# Altium project Arria10_NetBoard.PrjPcb (part 1 of 2)
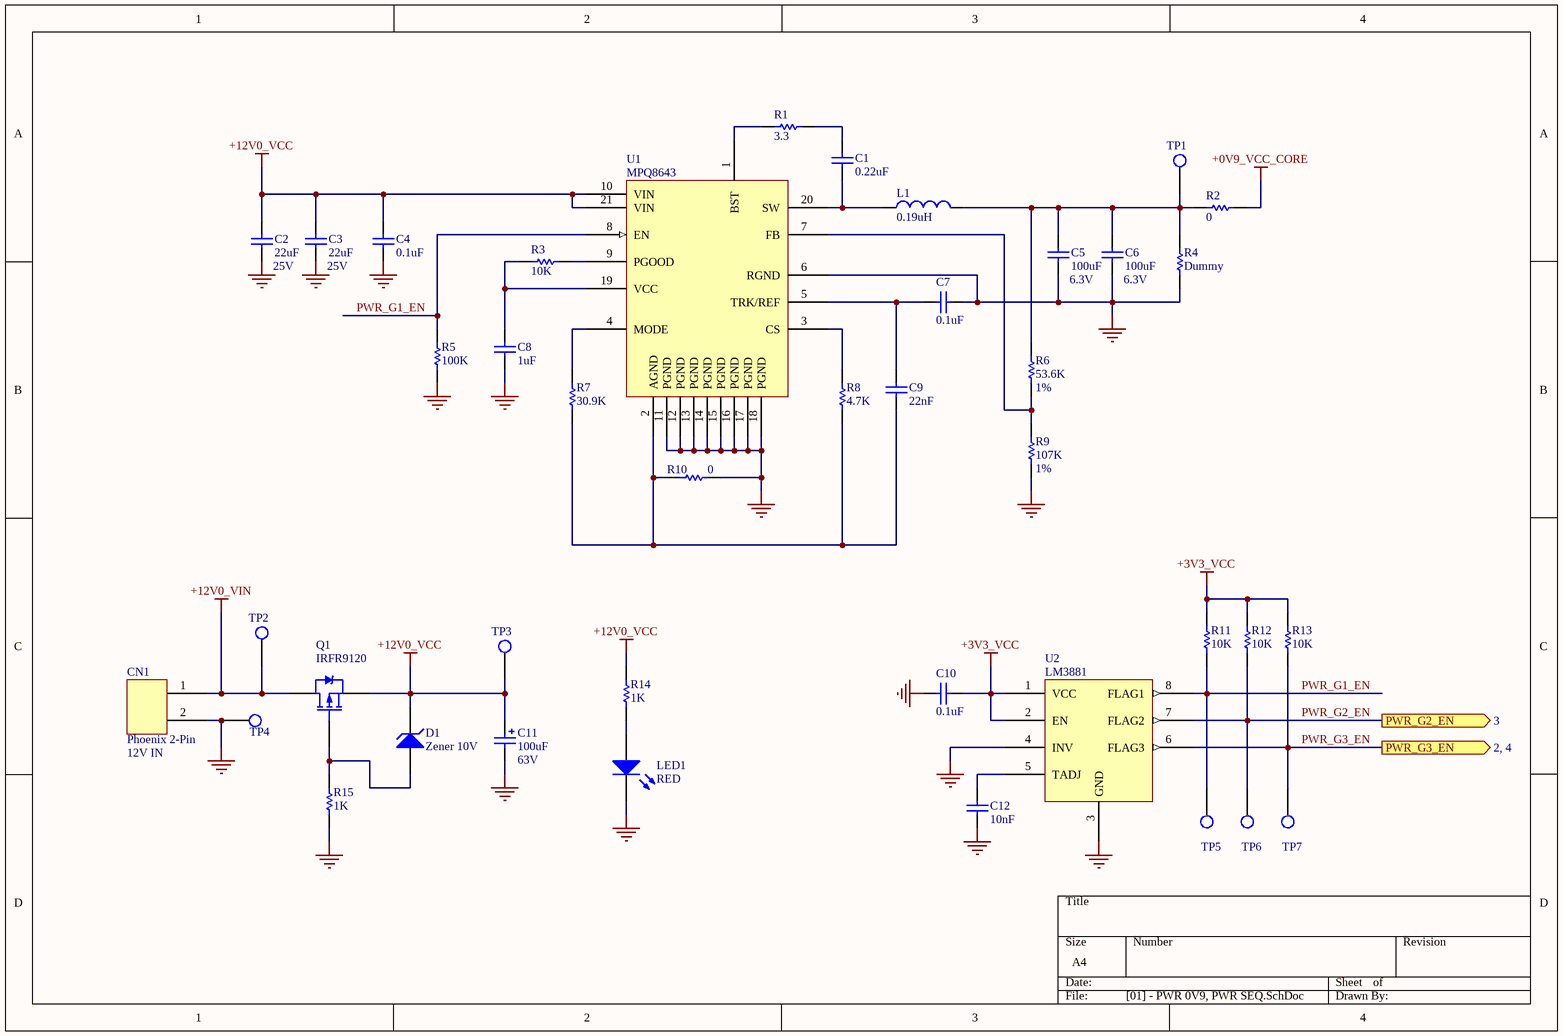
[diagram p0: [01] - PWR 0V9, PWR SEQ.SchDoc]
15 sheets, 570 parts. Net scope: flat (ports and power ports of the same name join across sheets).
Sheets:
  [00] - BLOCK DIAGRAM.SchDoc
  [01] - PWR 0V9, PWR SEQ.SchDoc
  [02] - PWR 1V8.SchDoc
  [03] - PWR 3V3, 1V0.SchDoc
  [04] - PWR 2V5, 1V8, 1V35.SchDoc
  [05] - FPGA PWR.SchDoc
  [06] - FPGA CONFIG, TEMP MON.SchDoc
  [07] - FPGA XCVR.SchDoc
  [08] - FPGA - DDR3.SchDoc
  [09] - FPGA IO BANK 2A, 2L.SchDoc
  [10] - FPGA IO BANK 3A.SchDoc
  [11] - MAIN CLOCKS.SchDoc
  [12] - REFERENCE CLOCKS.SchDoc
  [13] - SFP+ MODULES.SchDoc
  [14] - ETHERNET 10_100_1000.SchDoc

## Sheet [00] - BLOCK DIAGRAM.SchDoc
size A4; DocumentNumber: 0; SheetNumber: 0; SheetTotal: 15

## Sheet [01] - PWR 0V9, PWR SEQ.SchDoc
size A4; DocumentNumber: 1; SheetNumber: 1; SheetTotal: 15

### Parts
C1  0.22uF  [0402_C]
C2  22uF  RATED_VOLTAGE: 25V  [1210_C]
C3  22uF  RATED_VOLTAGE: 25V  [1210_C]
C4  0.1uF  [0402_C]
C5  100uF  RATED_VOLTAGE: 6.3V  [1210_C]
C6  100uF  RATED_VOLTAGE: 6.3V  [1210_C]
C7  0.1uF  [0402_C]
C8  1uF  [0402_C]
C9  22nF  [0402_C]
C10  0.1uF  [0402_C]
C11  100uF  RATED_VOLTAGE: 63V  [G_PANASONIC]
C12  10nF  [0402_C]
CN1  Phoenix 2-Pin  [PHOENIX_2PIN_RIGHT_200mil]
D1  Zener 10V  [SOD-123]
L1  0.19uH  [IHLP-4040]
LED1  RED  [LED_0805]
Q1  IRFR9120  [TO-252]
R1  3.3  [0402_R]
R2  0  [1210_R]
R3  10K  [0402_R]
R4  Dummy  [1210_R]
R5  100K  [0402_R]
R6  53.6K  Tolerance: 1%  [0402_R]
R7  30.9K  [0402_R]
R8  4.7K  [0402_R]
R9  107K  Tolerance: 1%  [0402_R]
R10  0  [0402_R]
R11  10K  [0402_R]
R12  10K  [0402_R]
R13  10K  [0402_R]
R14  1K  [0805_R]
R15  1K  [0805_R]
TP1  Test Point  [PIN_1.5mm]  (value not drawn)
TP2  Test Point  [PIN_1.5mm]  (value not drawn)
TP3  Test Point  [PIN_1.5mm]  (value not drawn)
TP4  Test Point  [PIN_1.5mm]  (value not drawn)
TP5  Test Point  [PIN_1mm]  (value not drawn)
TP6  Test Point  [PIN_1mm]  (value not drawn)
TP7  Test Point  [PIN_1mm]  (value not drawn)
U1  MPQ8643
U2  LM3881

### Ports
PWR_G2_EN (out, see 3), PWR_G3_EN (out, see 2, 4)

### Nets
+0V9_VCC_CORE: R2.2
+3V3_VCC: C10.1 R11.2 R12.2 R13.2 U2.1(VCC) U2.2(EN)
+12V0_VCC: C2.2 C3.2 C4.2 C11.1 D1.2(K) Q1.2(S) R14.2 TP3.1 U1.10(VIN) U1.21(VIN)
+12V0_VIN: CN1.1 Q1.3(D) TP2.1
GND: C2.1 C3.1 C4.1 C5.1 C6.1 C7.1 C8.1 C10.2 C11.2 C12.2 CN1.2 LED1.2(K) R4.1 R5.2 R9.1 R10.2 R15.1 TP4.1 U1.6(RGND) U1.11(PGND) U1.12(PGND) U1.13(PGND) U1.14(PGND) U1.15(PGND) U1.16(PGND) U1.17(PGND) U1.18(PGND) U2.3(GND) U2.4(INV)
PWR_G1_EN: R5.1 R11.1 TP5.1 U1.8(EN) U2.8(FLAG1)
PWR_G2_EN: R12.1 TP6.1 U2.7(FLAG2) ; port PWR_G2_EN
PWR_G3_EN: R13.1 TP7.1 U2.6(FLAG3) ; port PWR_G3_EN
NetC1_1: C1.1 L1.1 U1.20(SW)
NetC1_2: C1.2 R1.2
NetC5_2: C5.2 C6.2 L1.2 R2.1 R4.2 R6.2 TP1.1
NetC7_2: C7.2 C9.2 U1.5(TRK/REF)
NetC8_2: C8.2 R3.2 U1.19(VCC)
NetC9_1: C9.1 R7.1 R8.1 R10.1 U1.2(AGND)
NetC12_1: C12.1 U2.5(TADJ)
NetD1_1: D1.1(A) Q1.1(G) R15.2
NetLED1_1: LED1.1(A) R14.1
NetR1_1: R1.1 U1.1(BST)
NetR3_1: R3.1 U1.9(PGOOD)
NetR6_1: R6.1 R9.2 U1.7(FB)
NetR7_2: R7.2 U1.4(MODE)
NetR8_2: R8.2 U1.3(CS)

### Notes on the sheet
- (near CN1) 12V IN

### Library data of the parts
C1 = Cap SMD: Non-Pol SMD Capacitor; RATED_VOLTAGE: 25V; Value: 0.22uF; Manufacturer Part Num: *; Dielectric: *
C2 C3 = Cap SMD: Non-Pol SMD Capacitor; Manufacturer Part Num: GRM32ER71E226KE15; Dielectric: X7R; Value: 22uF
C4 C7-C10 C12 = Cap SMD: Non-Pol SMD Capacitor; RATED_VOLTAGE: 16V; Manufacturer Part Num: *; Dielectric: *
  C4 C7 C10: Value: 0.1uF
  C8: Value: 1uF
  C9: Value: 22nF
  C12: Value: 10nF
C5 C6 = Cap SMD: Non-Pol SMD Capacitor; Manufacturer Part Num: GRM32EC70J107ME15; Dielectric: X7S; Value: 100uF
C11 = Cap Aluminium Electrolytic: Aluminium Electrolytic Capacitor; Manufacturer Part Num: EEE-TG1J101UP; Value: 100uF
CN1 = Phoenix 2 pin: 2-Pin Phoenix Terminal; Value: Phoenix 2-Pin
D1 = Diode Zener: Zener Diode; Manufacturer Part Num: BZT52C10-7-F; Value: Zener 10V
L1 = Inductor: Inductor SMD; Manufacturer Part Num: IHLP4040DZERR19M11; Value: 0.19uH
LED1 = LED: Typical LED; Value: RED
Q1 = MOSFET P-CH: P-Channel Mosfet; Manufacturer Part Num: IRFR9120PBF; Value: IRFR9120
R1-R5 R7 R8 R10-R15 = Res SMD: SMD Resistor; Tolerance: 5%; Manufacturer Part Num: *
  R1: Value: 3.3
  R2 R10: Value: 0
  R3 R11-R13: Value: 10K
  R4: Value: Dummy
  R5: Value: 100K
  R7: Value: 30.9K
  R8: Value: 4.7K
  R14 R15: Value: 1K
R6 R9 = Res SMD: SMD Resistor; Manufacturer Part Num: *
  R6: Value: 53.6K
  R9: Value: 107K
TP1-TP7 = Test Point: Test Point Footprint; Value: Test Point
U1 = MPQ8643: 16V, 20A, Configurable-Frequency, Synchronous Step-Down Converter; Manufacturer Part Num: MPQ8643GLE-P; Value: MPQ8643
U2 = LM3881: Simple Power Sequencer With Adjustable Timing; Value: LM3881; Manufacturer Part Num: *

## Sheet [02] - PWR 1V8.SchDoc
size A4; DocumentNumber: 2; SheetNumber: 2; SheetTotal: 15
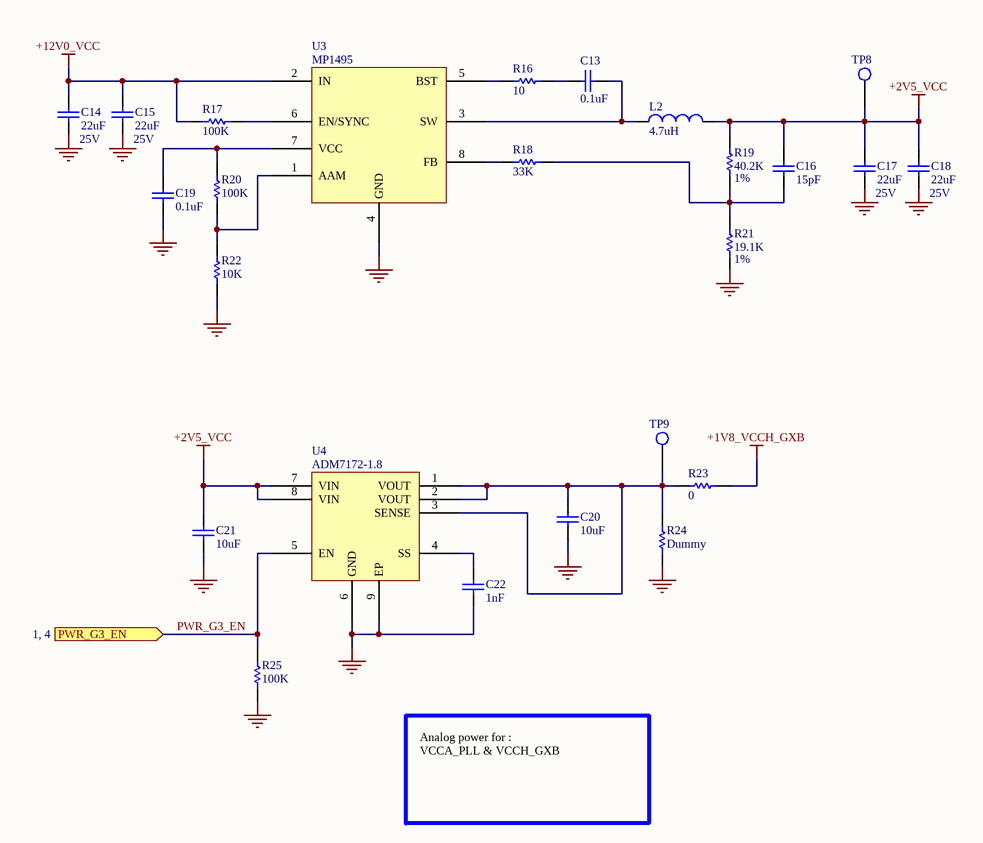
[diagram p1: [02] - PWR 1V8.SchDoc]

### Parts
C13  0.1uF  [0402_C]
C14  22uF  RATED_VOLTAGE: 25V  [1210_C]
C15  22uF  RATED_VOLTAGE: 25V  [1210_C]
C16  15pF  [0402_C]
C17  22uF  RATED_VOLTAGE: 25V  [1210_C]
C18  22uF  RATED_VOLTAGE: 25V  [1210_C]
C19  0.1uF  [0402_C]
C20  10uF  [0805_C]
C21  10uF  [0805_C]
C22  1nF  [0402_C]
L2  4.7uH  [IHLP-2525]
R16  10  [0402_R]
R17  100K  [0402_R]
R18  33K  [0402_R]
R19  40.2K  Tolerance: 1%  [0402_R]
R20  100K  [0402_R]
R21  19.1K  Tolerance: 1%  [0402_R]
R22  10K  [0402_R]
R23  0  [1210_R]
R24  Dummy  [1210_R]
R25  100K  [0402_R]
TP8  Test Point  [PIN_1.5mm]  (value not drawn)
TP9  Test Point  [PIN_1.5mm]  (value not drawn)
U3  MP1495  [TSOT23-8]
U4  ADM7172-1.8

### Ports
PWR_G3_EN (in, see 1, 4)

### Nets
+1V8_VCCH_GXB: R23.2
+2V5_VCC: C16.2 C17.2 C18.2 C21.2 L2.2 R19.2 TP8.1 U4.7(VIN) U4.8(VIN)
+12V0_VCC: C14.2 C15.2 R17.2 U3.2(IN)
GND: C14.1 C15.1 C17.1 C18.1 C19.1 C20.1 C21.1 C22.1 R21.1 R22.1 R24.1 R25.2 U3.4(GND) U4.6(GND) U4.9(EP)
PWR_G3_EN: R25.1 U4.5(EN) ; port PWR_G3_EN
NetC13_1: C13.1 R16.2
NetC13_2: C13.2 L2.1 U3.3(SW)
NetC16_1: C16.1 R18.2 R19.1 R21.2
NetC19_2: C19.2 R20.2 U3.7(VCC)
NetC20_2: C20.2 R23.1 R24.2 TP9.1 U4.1(VOUT) U4.2(VOUT) U4.3(SENSE)
NetC22_2: C22.2 U4.4(SS)
NetR16_1: R16.1 U3.5(BST)
NetR17_1: R17.1 U3.6(EN/SYNC)
NetR18_1: R18.1 U3.8(FB)
NetR20_1: R20.1 R22.2 U3.1(AAM)

### Notes on the sheet
- Analog power for :
  VCCA_PLL & VCCH_GXB

### Library data of the parts
C13 C19 = Cap SMD: as C1 on sheet [01] - PWR 0V9, PWR SEQ; Value: 0.1uF; Manufacturer Part Num: *; Dielectric: *
C14 C15 C17 C18 = Cap SMD: as C2 on sheet [01] - PWR 0V9, PWR SEQ; Value: 22uF
C16 C22 = Cap SMD: as C4 on sheet [01] - PWR 0V9, PWR SEQ; Manufacturer Part Num: *; Dielectric: *
  C16: Value: 15pF
  C22: Value: 1nF
C20 C21 = Cap SMD: Non-Pol SMD Capacitor; Manufacturer Part Num: GRM21BR71A106MA73; RATED_VOLTAGE: 10V; Dielectric: X7R; Value: 10uF
L2 = Inductor: Inductor SMD; Manufacturer Part Num: IHLP2525CZER4R7M01; Value: 4.7uH
R16-R18 R20 R22-R25 = Res SMD: SMD Resistor; Tolerance: 5%; Manufacturer Part Num: *
  R16: Value: 10
  R17 R20 R25: Value: 100K
  R18: Value: 33K
  R22: Value: 10K
  R23: Value: 0
  R24: Value: Dummy
R19 R21 = Res SMD: SMD Resistor; Manufacturer Part Num: *
  R19: Value: 40.2K
  R21: Value: 19.1K
TP8 TP9 = Test Point: Test Point Footprint; Value: Test Point
U3 = MP1495: High Efficiency 3A, 16V, 500kHz Synchronous Step Down Converter; Manufacturer Part Num: MP1495SGJ-Z; Value: MP1495
U4 = ADM7172: 6.5 V, 2 A, Ultralow Noise, High PSRR, Fast Transient Response CMOS LDO; Manufacturer Part Num: ADM7172ACPZ-1.8-R7; Value: ADM7172-1.8

## Sheet [03] - PWR 3V3, 1V0.SchDoc
size A4; DocumentNumber: 3; SheetNumber: 3; SheetTotal: 15
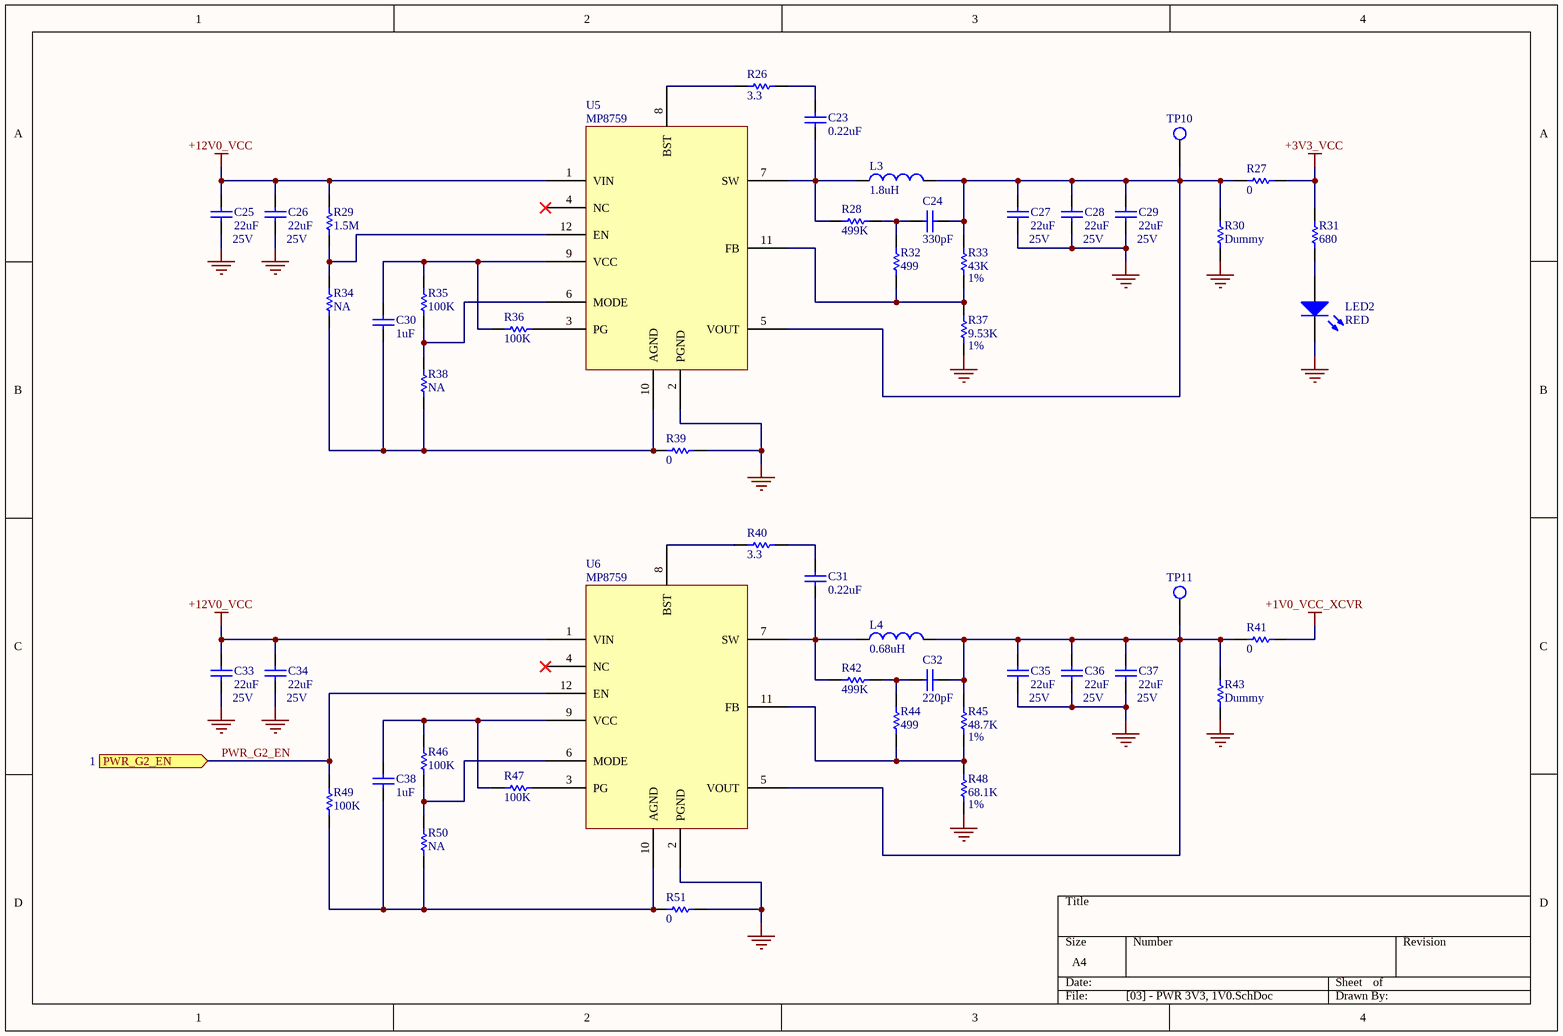
[diagram p2: [03] - PWR 3V3, 1V0.SchDoc]

### Parts
C23  0.22uF  [0402_C]
C24  330pF  [0402_C]
C25  22uF  RATED_VOLTAGE: 25V  [1210_C]
C26  22uF  RATED_VOLTAGE: 25V  [1210_C]
C27  22uF  RATED_VOLTAGE: 25V  [1210_C]
C28  22uF  RATED_VOLTAGE: 25V  [1210_C]
C29  22uF  RATED_VOLTAGE: 25V  [1210_C]
C30  1uF  [0402_C]
C31  0.22uF  [0402_C]
C32  220pF  [0402_C]
C33  22uF  RATED_VOLTAGE: 25V  [1210_C]
C34  22uF  RATED_VOLTAGE: 25V  [1210_C]
C35  22uF  RATED_VOLTAGE: 25V  [1210_C]
C36  22uF  RATED_VOLTAGE: 25V  [1210_C]
C37  22uF  RATED_VOLTAGE: 25V  [1210_C]
C38  1uF  [0402_C]
L3  1.8uH  [IHLP-4040]
L4  0.68uH  [IHLP-2525]
LED2  RED  [LED_0805]
R26  3.3  [0402_R]
R27  0  [1210_R]
R28  499K  [0402_R]
R29  1.5M  [0402_R]
R30  Dummy  [1210_R]
R31  680  [0805_R]
R32  499  [0402_R]
R33  43K  Tolerance: 1%  [0402_R]
R34  NA  [0402_R]
R35  100K  [0402_R]
R36  100K  [0402_R]
R37  9.53K  Tolerance: 1%  [0402_R]
R38  NA  [0402_R]
R39  0  [0402_R]
R40  3.3  [0402_R]
R41  0  [1210_R]
R42  499K  [0402_R]
R43  Dummy  [1210_R]
R44  499  [0402_R]
R45  48.7K  Tolerance: 1%  [0402_R]
R46  100K  [0402_R]
R47  100K  [0402_R]
R48  68.1K  Tolerance: 1%  [0402_R]
R49  100K  [0402_R]
R50  NA  [0402_R]
R51  0  [0402_R]
TP10  Test Point  [PIN_1.5mm]  (value not drawn)
TP11  Test Point  [PIN_1.5mm]  (value not drawn)
U5  MP8759
U6  MP8759

### Ports
PWR_G2_EN (in, see 1)

### Nets
+1V0_VCC_XCVR: R41.2
+3V3_VCC: R27.2 R31.2
+12V0_VCC: C25.2 C26.2 C33.2 C34.2 R29.1 U5.1(VIN) U6.1(VIN)
GND: C25.1 C26.1 C27.1 C28.1 C29.1 C33.1 C34.1 C35.1 C36.1 C37.1 LED2.2(K) R30.1 R37.1 R39.1 R43.1 R48.1 R51.1 U5.2(PGND) U6.2(PGND)
PWR_G2_EN: R49.1 U6.12(EN) ; port PWR_G2_EN
NetC23_1: C23.1 L3.1 R28.2 U5.7(SW)
NetC23_2: C23.2 R26.2
NetC24_1: C24.1 C27.2 C28.2 C29.2 L3.2 R27.1 R30.2 R33.2 TP10.1 U5.5(VOUT)
NetC24_2: C24.2 R28.1 R32.1
NetC30_1: C30.1 R34.2 R38.2 R39.2 U5.10(AGND)
NetC30_2: C30.2 R35.1 R36.2 U5.9(VCC)
NetC31_1: C31.1 L4.1 R42.2 U6.7(SW)
NetC31_2: C31.2 R40.2
NetC32_1: C32.1 C35.2 C36.2 C37.2 L4.2 R41.1 R43.2 R45.2 TP11.1 U6.5(VOUT)
NetC32_2: C32.2 R42.1 R44.1
NetC38_1: C38.1 R49.2 R50.2 R51.2 U6.10(AGND)
NetC38_2: C38.2 R46.1 R47.2 U6.9(VCC)
NetLED2_1: LED2.1(A) R31.1
NetR26_1: R26.1 U5.8(BST)
NetR29_2: R29.2 R34.1 U5.12(EN)
NetR32_2: R32.2 R33.1 R37.2 U5.11(FB)
NetR35_2: R35.2 R38.1 U5.6(MODE)
NetR36_1: R36.1 U5.3(PG)
NetR40_1: R40.1 U6.8(BST)
NetR44_2: R44.2 R45.1 R48.2 U6.11(FB)
NetR46_2: R46.2 R50.1 U6.6(MODE)
NetR47_1: R47.1 U6.3(PG)

Not connected (* = marked no-connect by the designer): U5 4(NC)*; U6 4(NC)*

### Library data of the parts
C23 C31 = Cap SMD: as C1 on sheet [01] - PWR 0V9, PWR SEQ; Value: 0.22uF; Manufacturer Part Num: *; Dielectric: *
C24 C32 = Cap SMD: as C4 on sheet [01] - PWR 0V9, PWR SEQ; Manufacturer Part Num: *; Dielectric: *
  C24: Value: 330pF
  C32: Value: 220pF
C25-C29 C33-C37 = Cap SMD: as C2 on sheet [01] - PWR 0V9, PWR SEQ; Value: 22uF
C30 C38 = Cap SMD: Non-Pol SMD Capacitor; Manufacturer Part Num: GCM155C71A105ME38; RATED_VOLTAGE: 10V; Dielectric: X7S; Value: 1uF
L3 = Inductor: Inductor SMD; Manufacturer Part Num: IHLP4040DZER1R8M11; Value: 1.8uH
L4 = Inductor: Inductor SMD; Manufacturer Part Num: IHLP2525CZERR68M01; Value: 0.68uH
LED2 = LED: Typical LED; Value: RED
R26 R27 R29-R31 R34-R36 R38-R41 R43 R46 R47 R49-R51 = Res SMD: SMD Resistor; Tolerance: 5%; Manufacturer Part Num: *
  R26 R40: Value: 3.3
  R27 R39 R41 R51: Value: 0
  R29: Value: 1.5M
  R30 R43: Value: Dummy
  R31: Value: 680
  R34 R38 R50: Value: NA
  R35 R36 R46 R47 R49: Value: 100K
R28 R32 R42 R44 = Res SMD: SMD Resistor; Tolerance: 1%; Manufacturer Part Num: *
  R28 R42: Value: 499K
  R32 R44: Value: 499
R33 R37 R45 R48 = Res SMD: SMD Resistor; Manufacturer Part Num: *
  R33: Value: 43K
  R37: Value: 9.53K
  R45: Value: 48.7K
  R48: Value: 68.1K
TP10 TP11 = Test Point: Test Point Footprint; Value: Test Point
U5 U6 = MP8759: 26V, 8A, Low I Q , High-Current,  Synchronous, Step-Down Converter; Manufacturer Part Num: MP8759GD; Value: MP8759

## Sheet [04] - PWR 2V5, 1V8, 1V35.SchDoc
size A4; DocumentNumber: 4; SheetNumber: 4; SheetTotal: 15
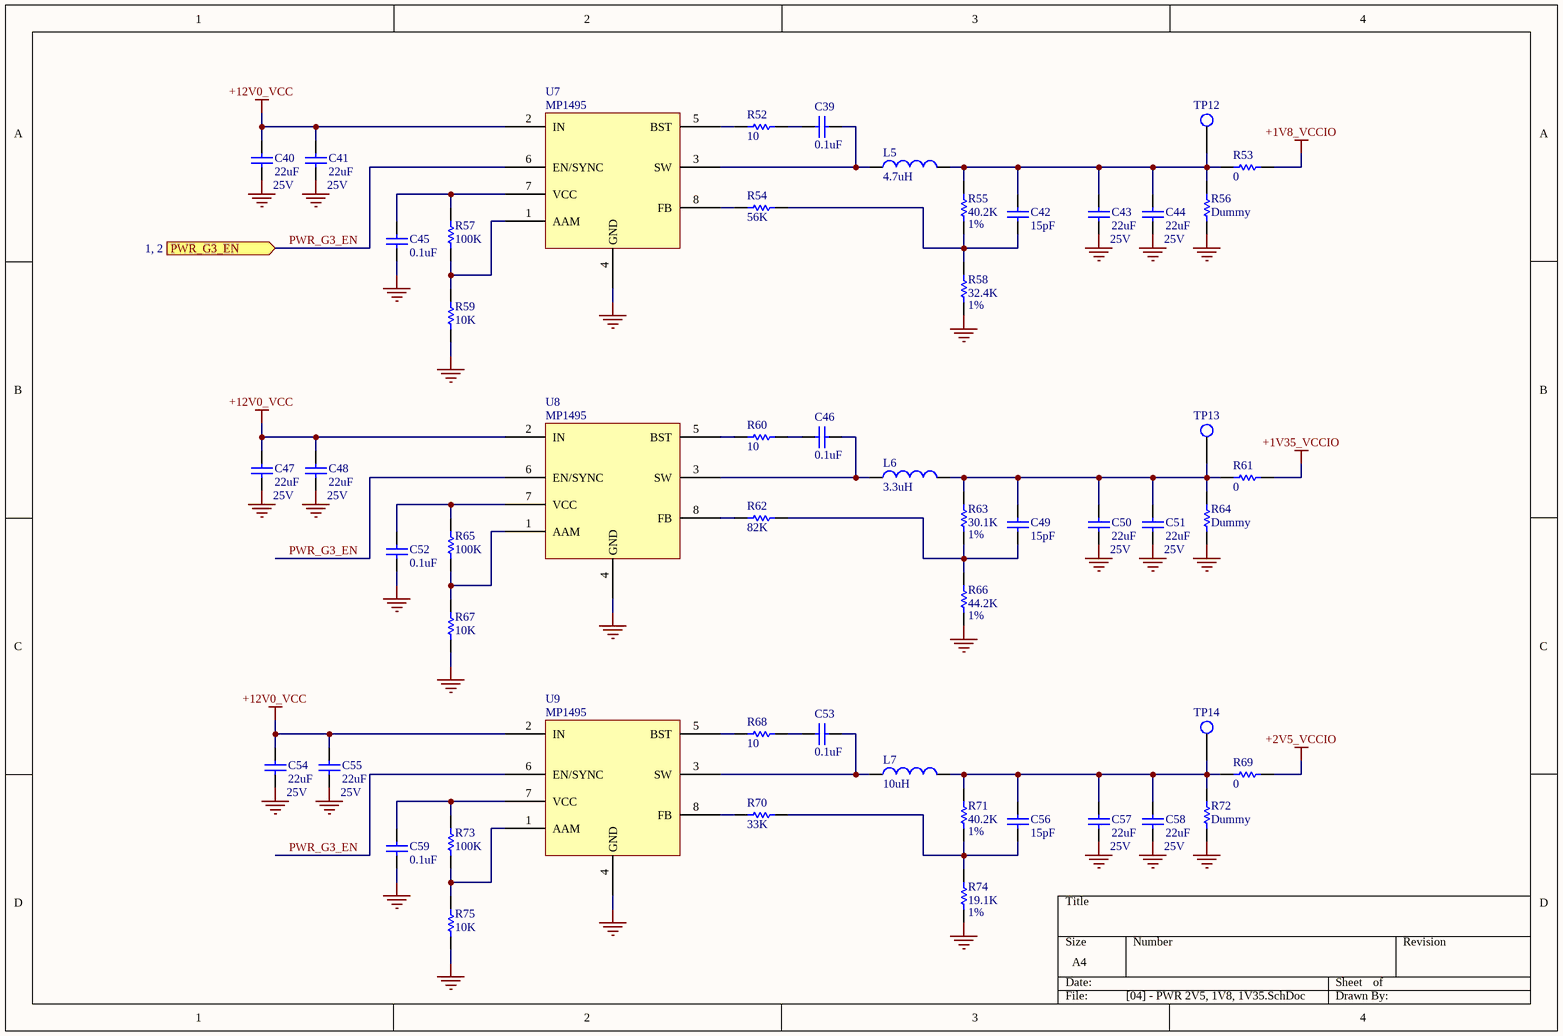
[diagram p3: [04] - PWR 2V5, 1V8, 1V35.SchDoc]

### Parts
C39  0.1uF  [0402_C]
C40  22uF  RATED_VOLTAGE: 25V  [1210_C]
C41  22uF  RATED_VOLTAGE: 25V  [1210_C]
C42  15pF  [0402_C]
C43  22uF  RATED_VOLTAGE: 25V  [1210_C]
C44  22uF  RATED_VOLTAGE: 25V  [1210_C]
C45  0.1uF  [0402_C]
C46  0.1uF  [0402_C]
C47  22uF  RATED_VOLTAGE: 25V  [1210_C]
C48  22uF  RATED_VOLTAGE: 25V  [1210_C]
C49  15pF  [0402_C]
C50  22uF  RATED_VOLTAGE: 25V  [1210_C]
C51  22uF  RATED_VOLTAGE: 25V  [1210_C]
C52  0.1uF  [0402_C]
C53  0.1uF  [0402_C]
C54  22uF  RATED_VOLTAGE: 25V  [1210_C]
C55  22uF  RATED_VOLTAGE: 25V  [1210_C]
C56  15pF  [0402_C]
C57  22uF  RATED_VOLTAGE: 25V  [1210_C]
C58  22uF  RATED_VOLTAGE: 25V  [1210_C]
C59  0.1uF  [0402_C]
L5  4.7uH  [IHLP-2525]
L6  3.3uH  [IHLP-2020]
L7  10uH  [IHLP-2525]
R52  10  [0402_R]
R53  0  [1210_R]
R54  56K  [0402_R]
R55  40.2K  Tolerance: 1%  [0402_R]
R56  Dummy  [1210_R]
R57  100K  [0402_R]
R58  32.4K  Tolerance: 1%  [0402_R]
R59  10K  [0402_R]
R60  10  [0402_R]
R61  0  [1210_R]
R62  82K  [0402_R]
R63  30.1K  Tolerance: 1%  [0402_R]
R64  Dummy  [1210_R]
R65  100K  [0402_R]
R66  44.2K  Tolerance: 1%  [0402_R]
R67  10K  [0402_R]
R68  10  [0402_R]
R69  0  [1210_R]
R70  33K  [0402_R]
R71  40.2K  Tolerance: 1%  [0402_R]
R72  Dummy  [1210_R]
R73  100K  [0402_R]
R74  19.1K  Tolerance: 1%  [0402_R]
R75  10K  [0402_R]
TP12  Test Point  [PIN_1.5mm]  (value not drawn)
TP13  Test Point  [PIN_1.5mm]  (value not drawn)
TP14  Test Point  [PIN_1.5mm]  (value not drawn)
U7  MP1495  [TSOT23-8]
U8  MP1495  [TSOT23-8]
U9  MP1495  [TSOT23-8]

### Ports
PWR_G3_EN (in, see 1, 2)

### Nets
+1V8_VCCIO: R53.2
+1V35_VCCIO: R61.2
+2V5_VCCIO: R69.2
+12V0_VCC: C40.2 C41.2 C47.2 C48.2 C54.2 C55.2 U7.2(IN) U8.2(IN) U9.2(IN)
GND: C40.1 C41.1 C43.1 C44.1 C45.1 C47.1 C48.1 C50.1 C51.1 C52.1 C54.1 C55.1 C57.1 C58.1 C59.1 R56.1 R58.1 R59.1 R64.1 R66.1 R67.1 R72.1 R74.1 R75.1 U7.4(GND) U8.4(GND) U9.4(GND)
PWR_G3_EN: U7.6(EN/SYNC) U8.6(EN/SYNC) U9.6(EN/SYNC) ; port PWR_G3_EN
NetC39_1: C39.1 R52.2
NetC39_2: C39.2 L5.1 U7.3(SW)
NetC42_1: C42.1 R54.2 R55.1 R58.2
NetC42_2: C42.2 C43.2 C44.2 L5.2 R53.1 R55.2 R56.2 TP12.1
NetC45_2: C45.2 R57.2 U7.7(VCC)
NetC46_1: C46.1 R60.2
NetC46_2: C46.2 L6.1 U8.3(SW)
NetC49_1: C49.1 R62.2 R63.1 R66.2
NetC49_2: C49.2 C50.2 C51.2 L6.2 R61.1 R63.2 R64.2 TP13.1
NetC52_2: C52.2 R65.2 U8.7(VCC)
NetC53_1: C53.1 R68.2
NetC53_2: C53.2 L7.1 U9.3(SW)
NetC56_1: C56.1 R70.2 R71.1 R74.2
NetC56_2: C56.2 C57.2 C58.2 L7.2 R69.1 R71.2 R72.2 TP14.1
NetC59_2: C59.2 R73.2 U9.7(VCC)
NetR52_1: R52.1 U7.5(BST)
NetR54_1: R54.1 U7.8(FB)
NetR57_1: R57.1 R59.2 U7.1(AAM)
NetR60_1: R60.1 U8.5(BST)
NetR62_1: R62.1 U8.8(FB)
NetR65_1: R65.1 R67.2 U8.1(AAM)
NetR68_1: R68.1 U9.5(BST)
NetR70_1: R70.1 U9.8(FB)
NetR73_1: R73.1 R75.2 U9.1(AAM)

### Library data of the parts
C39 C45 C46 C52 C53 C59 = Cap SMD: as C1 on sheet [01] - PWR 0V9, PWR SEQ; Value: 0.1uF; Manufacturer Part Num: *; Dielectric: *
C40 C41 C43 C44 C47 C48 C50 C51 C54 C55 C57 C58 = Cap SMD: as C2 on sheet [01] - PWR 0V9, PWR SEQ; Value: 22uF
C42 C49 C56 = Cap SMD: as C4 on sheet [01] - PWR 0V9, PWR SEQ; Value: 15pF; Manufacturer Part Num: *; Dielectric: *
L5 = Inductor: as L2 on sheet [02] - PWR 1V8; Value: 4.7uH
L6 = Inductor: Inductor SMD; Manufacturer Part Num: IHLP2020BZER3R3M5A; Value: 3.3uH
L7 = Inductor: Inductor SMD; Manufacturer Part Num: IHLP2525CZER100M01; Value: 10uH
R52-R54 R56 R57 R59-R62 R64 R65 R67-R70 R72 R73 R75 = Res SMD: SMD Resistor; Tolerance: 5%; Manufacturer Part Num: *
  R52 R60 R68: Value: 10
  R53 R61 R69: Value: 0
  R54: Value: 56K
  R56 R64 R72: Value: Dummy
  R57 R65 R73: Value: 100K
  R59 R67 R75: Value: 10K
  R62: Value: 82K
  R70: Value: 33K
R55 R58 R63 R66 R71 R74 = Res SMD: SMD Resistor; Manufacturer Part Num: *
  R55 R71: Value: 40.2K
  R58: Value: 32.4K
  R63: Value: 30.1K
  R66: Value: 44.2K
  R74: Value: 19.1K
TP12-TP14 = Test Point: Test Point Footprint; Value: Test Point
U7-U9 = MP1495: as U3 on sheet [02] - PWR 1V8; Value: MP1495

## Sheet [05] - FPGA PWR.SchDoc
size A3; DocumentNumber: 5; SheetNumber: 5; SheetTotal: 15
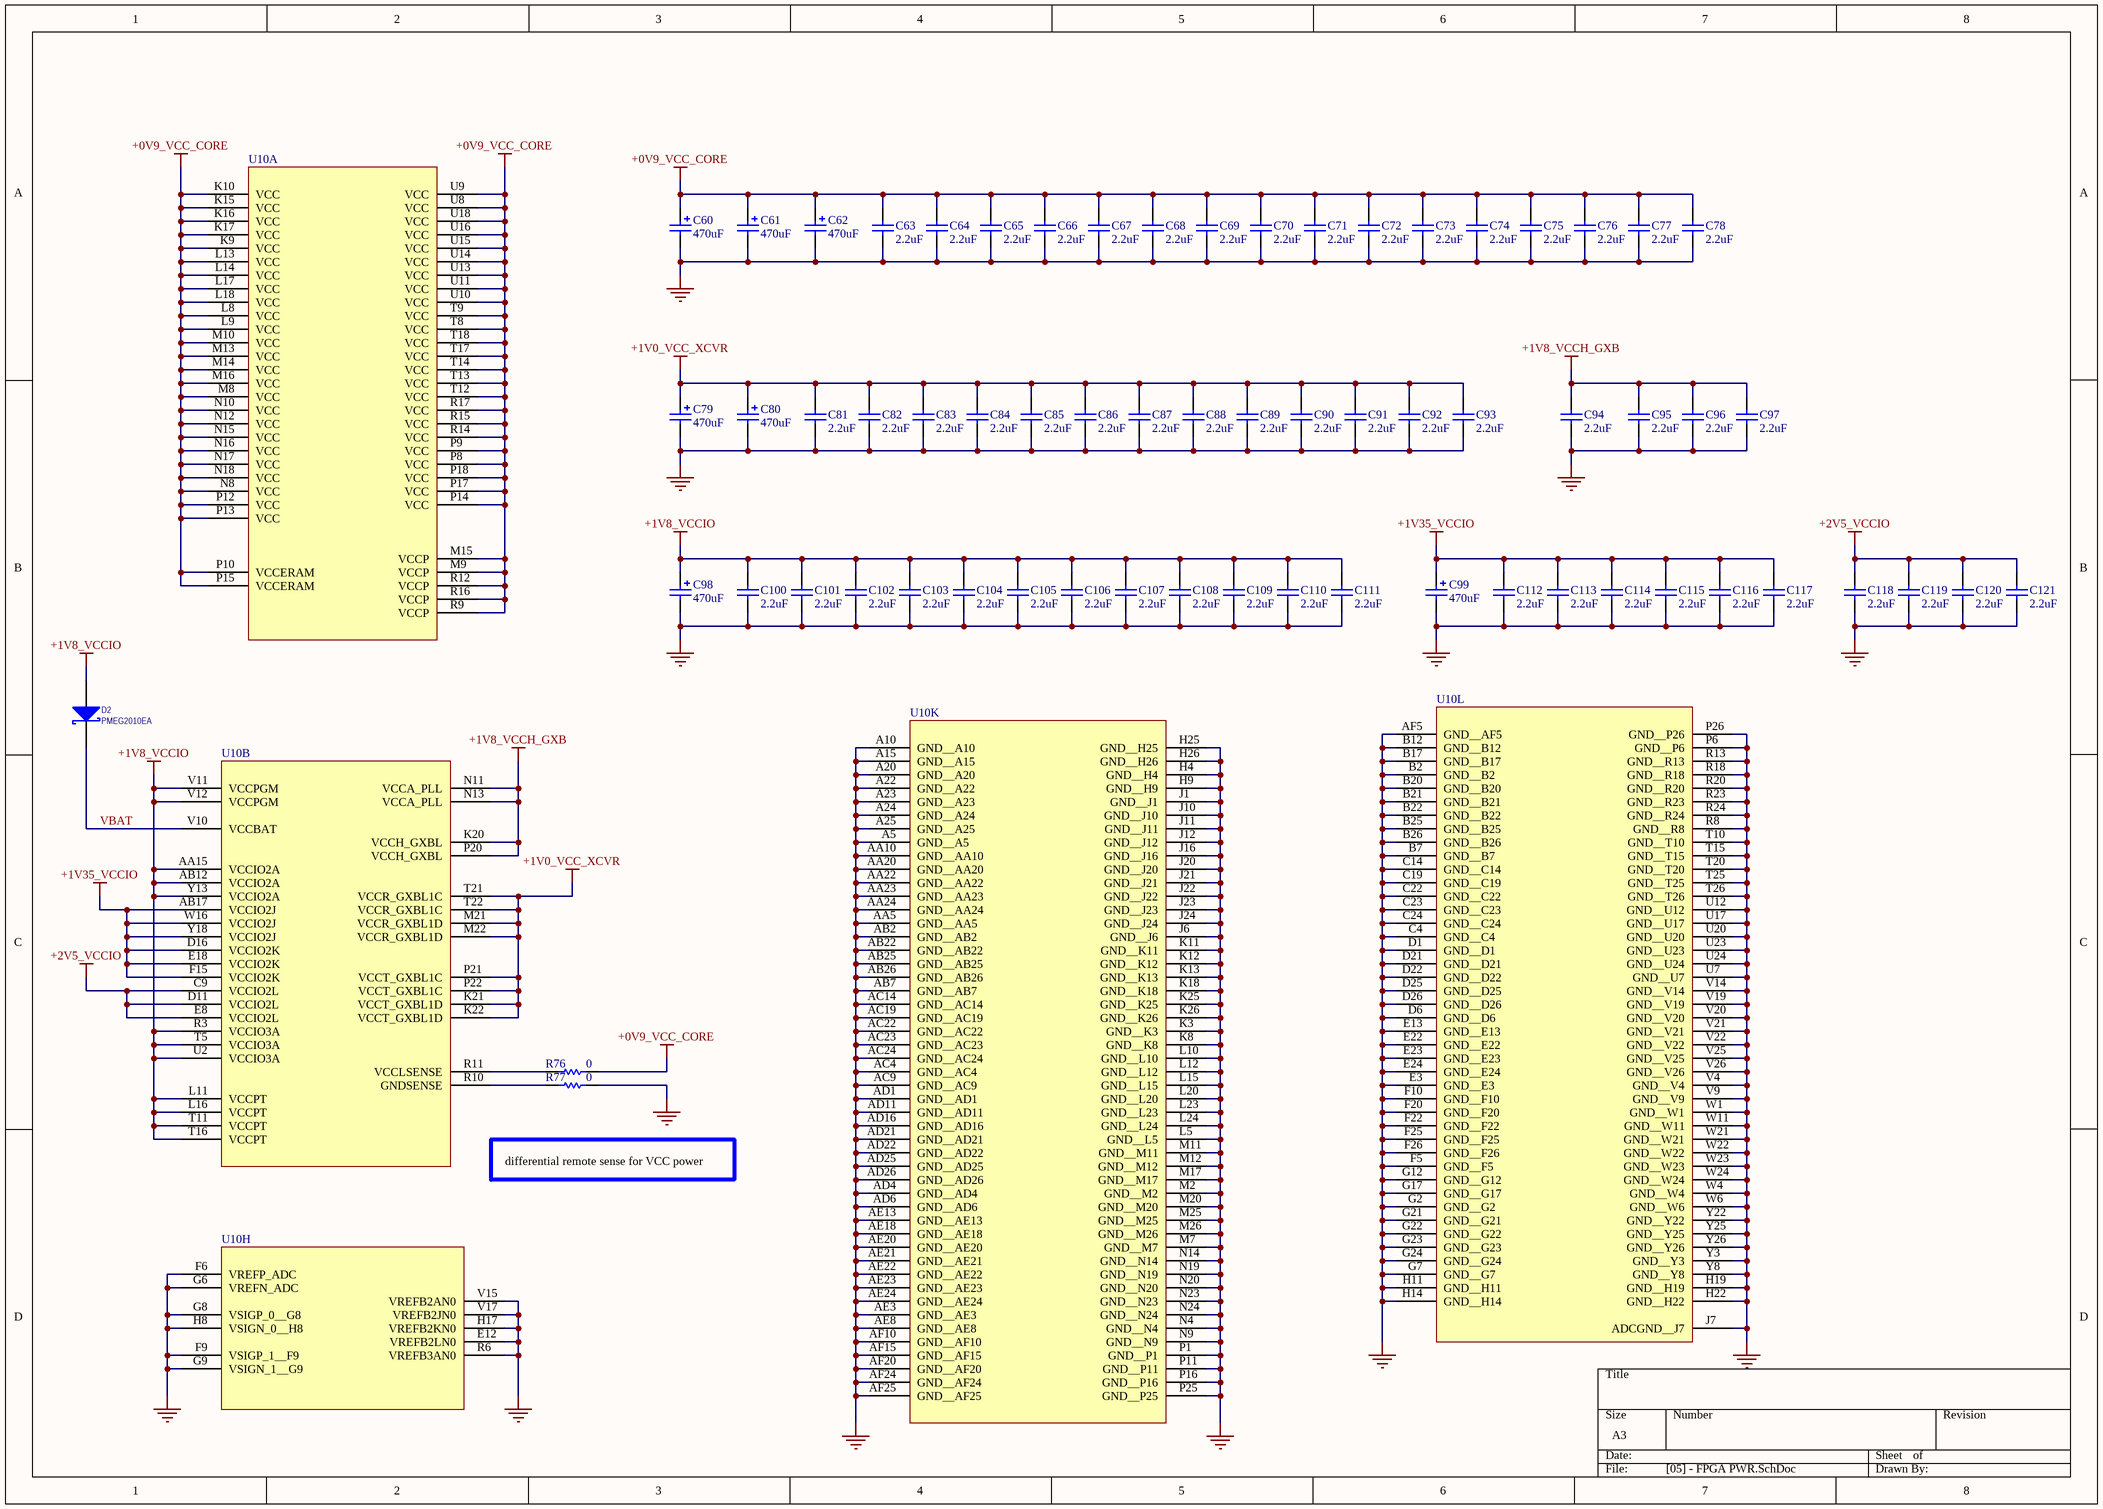
[diagram p4: [05] - FPGA PWR.SchDoc]

### Parts
C60  470uF  [TANT_D]
C61  470uF  [TANT_D]
C62  470uF  [TANT_D]
C63  2.2uF  [0402_C]
C64  2.2uF  [0402_C]
C65  2.2uF  [0402_C]
C66  2.2uF  [0402_C]
C67  2.2uF  [0402_C]
C68  2.2uF  [0402_C]
C69  2.2uF  [0402_C]
C70  2.2uF  [0402_C]
C71  2.2uF  [0402_C]
C72  2.2uF  [0402_C]
C73  2.2uF  [0402_C]
C74  2.2uF  [0402_C]
C75  2.2uF  [0402_C]
C76  2.2uF  [0402_C]
C77  2.2uF  [0402_C]
C78  2.2uF  [0402_C]
C79  470uF  [TANT_D]
C80  470uF  [TANT_D]
C81  2.2uF  [0402_C]
C82  2.2uF  [0402_C]
C83  2.2uF  [0402_C]
C84  2.2uF  [0402_C]
C85  2.2uF  [0402_C]
C86  2.2uF  [0402_C]
C87  2.2uF  [0402_C]
C88  2.2uF  [0402_C]
C89  2.2uF  [0402_C]
C90  2.2uF  [0402_C]
C91  2.2uF  [0402_C]
C92  2.2uF  [0402_C]
C93  2.2uF  [0402_C]
C94  2.2uF  [0402_C]
C95  2.2uF  [0402_C]
C96  2.2uF  [0402_C]
C97  2.2uF  [0402_C]
C98  470uF  [TANT_D]
C99  470uF  [TANT_D]
C100  2.2uF  [0402_C]
C101  2.2uF  [0402_C]
C102  2.2uF  [0402_C]
C103  2.2uF  [0402_C]
C104  2.2uF  [0402_C]
C105  2.2uF  [0402_C]
C106  2.2uF  [0402_C]
C107  2.2uF  [0402_C]
C108  2.2uF  [0402_C]
C109  2.2uF  [0402_C]
C110  2.2uF  [0402_C]
C111  2.2uF  [0402_C]
C112  2.2uF  [0402_C]
C113  2.2uF  [0402_C]
C114  2.2uF  [0402_C]
C115  2.2uF  [0402_C]
C116  2.2uF  [0402_C]
C117  2.2uF  [0402_C]
C118  2.2uF  [0402_C]
C119  2.2uF  [0402_C]
C120  2.2uF  [0402_C]
C121  2.2uF  [0402_C]
D2  PMEG2010EA  [SMA]
R76  0  [0402_R]
R77  0  [0402_R]
U10  10AX016 F27  [FBGA672]  (value not drawn)  (parts A,B,H,K,L of 12)

### Nets
+0V9_VCC_CORE: C60.1 C61.1 C62.1 C63.2 C64.2 C65.2 C66.2 C67.2 C68.2 C69.2 C70.2 C71.2 C72.2 C73.2 C74.2 C75.2 C76.2 C77.2 C78.2 R76.2 U10.K9(VCC) U10.K10(VCC) U10.K15(VCC) U10.K16(VCC) U10.K17(VCC) U10.L8(VCC) U10.L9(VCC) U10.L13(VCC) U10.L14(VCC) U10.L17(VCC) U10.L18(VCC) U10.M8(VCC) U10.M9(VCCP) U10.M10(VCC) U10.M13(VCC) U10.M14(VCC) U10.M15(VCCP) U10.M16(VCC) U10.N8(VCC) U10.N10(VCC) U10.N12(VCC) U10.N15(VCC) U10.N16(VCC) U10.N17(VCC) U10.N18(VCC) U10.P8(VCC) U10.P9(VCC) U10.P10(VCCERAM) U10.P12(VCC) U10.P13(VCC) U10.P14(VCC) U10.P15(VCCERAM) U10.P17(VCC) U10.P18(VCC) U10.R9(VCCP) U10.R12(VCCP) U10.R14(VCC) U10.R15(VCC) U10.R16(VCCP) U10.R17(VCC) U10.T8(VCC) U10.T9(VCC) U10.T12(VCC) U10.T13(VCC) U10.T14(VCC) U10.T17(VCC) U10.T18(VCC) U10.U8(VCC) U10.U9(VCC) U10.U10(VCC) U10.U11(VCC) U10.U13(VCC) U10.U14(VCC) U10.U15(VCC) U10.U16(VCC) U10.U18(VCC)
+1V0_VCC_XCVR: C79.1 C80.1 C81.2 C82.2 C83.2 C84.2 C85.2 C86.2 C87.2 C88.2 C89.2 C90.2 C91.2 C92.2 C93.2 U10.K21(VCCT_GXBL1D) U10.K22(VCCT_GXBL1D) U10.M21(VCCR_GXBL1D) U10.M22(VCCR_GXBL1D) U10.P21(VCCT_GXBL1C) U10.P22(VCCT_GXBL1C) U10.T21(VCCR_GXBL1C) U10.T22(VCCR_GXBL1C)
+1V8_VCCH_GXB: C94.2 C95.2 C96.2 C97.2 U10.K20(VCCH_GXBL) U10.N11(VCCA_PLL) U10.N13(VCCA_PLL) U10.P20(VCCH_GXBL)
+1V8_VCCIO: C98.1 C100.2 C101.2 C102.2 C103.2 C104.2 C105.2 C106.2 C107.2 C108.2 C109.2 C110.2 C111.2 D2.1(A) U10.AA15(VCCIO2A) U10.AB12(VCCIO2A) U10.L11(VCCPT) U10.L16(VCCPT) U10.R3(VCCIO3A) U10.T5(VCCIO3A) U10.T11(VCCPT) U10.T16(VCCPT) U10.U2(VCCIO3A) U10.V11(VCCPGM) U10.V12(VCCPGM) U10.Y13(VCCIO2A)
+1V35_VCCIO: C99.1 C112.2 C113.2 C114.2 C115.2 C116.2 C117.2 U10.AB17(VCCIO2J) U10.D16(VCCIO2K) U10.E18(VCCIO2K) U10.F15(VCCIO2K) U10.W16(VCCIO2J) U10.Y18(VCCIO2J)
+2V5_VCCIO: C118.2 C119.2 C120.2 C121.2 U10.C9(VCCIO2L) U10.D11(VCCIO2L) U10.E8(VCCIO2L)
GND: C60.2 C61.2 C62.2 C63.1 C64.1 C65.1 C66.1 C67.1 C68.1 C69.1 C70.1 C71.1 C72.1 C73.1 C74.1 C75.1 C76.1 C77.1 C78.1 C79.2 C80.2 C81.1 C82.1 C83.1 C84.1 C85.1 C86.1 C87.1 C88.1 C89.1 C90.1 C91.1 C92.1 C93.1 C94.1 C95.1 C96.1 C97.1 C98.2 C99.2 C100.1 C101.1 C102.1 C103.1 C104.1 C105.1 C106.1 C107.1 C108.1 C109.1 C110.1 C111.1 C112.1 C113.1 C114.1 C115.1 C116.1 C117.1 C118.1 C119.1 C120.1 C121.1 R77.2 U10.A5(GND__A5) U10.A10(GND__A10) U10.A15(GND__A15) U10.A20(GND__A20) U10.A22(GND__A22) U10.A23(GND__A23) U10.A24(GND__A24) U10.A25(GND__A25) U10.AA5(GND__AA5) U10.AA10(GND__AA10) U10.AA20(GND__AA20) U10.AA22(GND__AA22) U10.AA23(GND__AA23) U10.AA24(GND__AA24) U10.AB2(GND__AB2) U10.AB7(GND__AB7) U10.AB22(GND__AB22) U10.AB25(GND__AB25) U10.AB26(GND__AB26) U10.AC4(GND__AC4) U10.AC9(GND__AC9) U10.AC14(GND__AC14) U10.AC19(GND__AC19) U10.AC22(GND__AC22) U10.AC23(GND__AC23) U10.AC24(GND__AC24) U10.AD1(GND__AD1) U10.AD4(GND__AD4) U10.AD6(GND__AD6) U10.AD11(GND__AD11) U10.AD16(GND__AD16) U10.AD21(GND__AD21) U10.AD22(GND__AD22) U10.AD25(GND__AD25) U10.AD26(GND__AD26) U10.AE3(GND__AE3) U10.AE8(GND__AE8) U10.AE13(GND__AE13) U10.AE18(GND__AE18) U10.AE20(GND__AE20) U10.AE21(GND__AE21) U10.AE22(GND__AE22) U10.AE23(GND__AE23) U10.AE24(GND__AE24) U10.AF5(GND__AF5) U10.AF10(GND__AF10) U10.AF15(GND__AF15) U10.AF20(GND__AF20) U10.AF24(GND__AF24) U10.AF25(GND__AF25) U10.B2(GND__B2) U10.B7(GND__B7) U10.B12(GND__B12) U10.B17(GND__B17) U10.B20(GND__B20) U10.B21(GND__B21) U10.B22(GND__B22) U10.B25(GND__B25) U10.B26(GND__B26) U10.C4(GND__C4) U10.C14(GND__C14) U10.C19(GND__C19) U10.C22(GND__C22) U10.C23(GND__C23) U10.C24(GND__C24) U10.D1(GND__D1) U10.D6(GND__D6) U10.D21(GND__D21) U10.D22(GND__D22) U10.D25(GND__D25) U10.D26(GND__D26) U10.E3(GND__E3) U10.E12(VREFB2LN0) U10.E13(GND__E13) U10.E22(GND__E22) U10.E23(GND__E23) U10.E24(GND__E24) U10.F5(GND__F5) U10.F6(VREFP_ADC) U10.F9(VSIGP_1__F9) U10.F10(GND__F10) U10.F20(GND__F20) U10.F22(GND__F22) U10.F25(GND__F25) U10.F26(GND__F26) U10.G2(GND__G2) U10.G6(VREFN_ADC) U10.G7(GND__G7) U10.G8(VSIGP_0__G8) U10.G9(VSIGN_1__G9) U10.G12(GND__G12) U10.G17(GND__G17) U10.G21(GND__G21) U10.G22(GND__G22) U10.G23(GND__G23) U10.G24(GND__G24) U10.H4(GND__H4) U10.H8(VSIGN_0__H8) U10.H9(GND__H9) U10.H11(GND__H11) U10.H14(GND__H14) U10.H17(VREFB2KN0) U10.H19(GND__H19) U10.H22(GND__H22) U10.H25(GND__H25) U10.H26(GND__H26) U10.J1(GND__J1) U10.J6(GND__J6) U10.J7(ADCGND__J7) U10.J10(GND__J10) U10.J11(GND__J11) U10.J12(GND__J12) U10.J16(GND__J16) U10.J20(GND__J20) U10.J21(GND__J21) U10.J22(GND__J22) U10.J23(GND__J23) U10.J24(GND__J24) U10.K3(GND__K3) U10.K8(GND__K8) U10.K11(GND__K11) U10.K12(GND__K12) U10.K13(GND__K13) U10.K18(GND__K18) U10.K25(GND__K25) U10.K26(GND__K26) U10.L5(GND__L5) U10.L10(GND__L10) U10.L12(GND__L12) U10.L15(GND__L15) U10.L20(GND__L20) U10.L23(GND__L23) U10.L24(GND__L24) U10.M2(GND__M2) U10.M7(GND__M7) U10.M11(GND__M11) U10.M12(GND__M12) U10.M17(GND__M17) U10.M20(GND__M20) U10.M25(GND__M25) U10.M26(GND__M26) U10.N4(GND__N4) U10.N9(GND__N9) U10.N14(GND__N14) U10.N19(GND__N19) U10.N20(GND__N20) U10.N23(GND__N23) U10.N24(GND__N24) U10.P1(GND__P1) U10.P6(GND__P6) U10.P11(GND__P11) U10.P16(GND__P16) U10.P25(GND__P25) U10.P26(GND__P26) U10.R6(VREFB3AN0) U10.R8(GND__R8) U10.R13(GND__R13) U10.R18(GND__R18) U10.R20(GND__R20) U10.R23(GND__R23) U10.R24(GND__R24) U10.T10(GND__T10) U10.T15(GND__T15) U10.T20(GND__T20) U10.T25(GND__T25) U10.T26(GND__T26) U10.U7(GND__U7) U10.U12(GND__U12) U10.U17(GND__U17) U10.U20(GND__U20) U10.U23(GND__U23) U10.U24(GND__U24) U10.V4(GND__V4) U10.V9(GND__V9) U10.V14(GND__V14) U10.V15(VREFB2AN0) U10.V17(VREFB2JN0) U10.V19(GND__V19) U10.V20(GND__V20) U10.V21(GND__V21) U10.V22(GND__V22) U10.V25(GND__V25) U10.V26(GND__V26) U10.W1(GND__W1) U10.W4(GND__W4) U10.W6(GND__W6) U10.W11(GND__W11) U10.W21(GND__W21) U10.W22(GND__W22) U10.W23(GND__W23) U10.W24(GND__W24) U10.Y3(GND__Y3) U10.Y8(GND__Y8) U10.Y22(GND__Y22) U10.Y25(GND__Y25) U10.Y26(GND__Y26)
VBAT: D2.2(K) U10.V10(VCCBAT)
NetR76_1: R76.1 U10.R11(VCCLSENSE)
NetR77_1: R77.1 U10.R10(GNDSENSE)

### Notes on the sheet
- differential remote sense for VCC power

### Library data of the parts
C60-C62 C79 C80 C98 C99 = Cap Tant: Tantalum Polarized Capacitor; Manufacturer Part Num: T520D477M006ATE025; RATED_VOLTAGE: 6.3V; Value: 470uF
C63-C78 C81-C97 C100-C121 = Cap SMD: Non-Pol SMD Capacitor; Manufacturer Part Num: GRM155Z71A225ME43D; RATED_VOLTAGE: 10V; Dielectric: X7R; Value: 2.2uF
D2 = Diode Schottky: Schottky Diode; Value: PMEG2010EA; Manufacturer Part Num: *
R76 R77 = Res SMD: SMD Resistor; Tolerance: 5%; Value: 0; Manufacturer Part Num: *
U10 = 10AX016: Manufacturer Part Num: 10AX016E4F27E3SG; Value: 10AX016 F27

## Sheet [06] - FPGA CONFIG, TEMP MON.SchDoc
size A4; DocumentNumber: 6; SheetNumber: 6; SheetTotal: 15
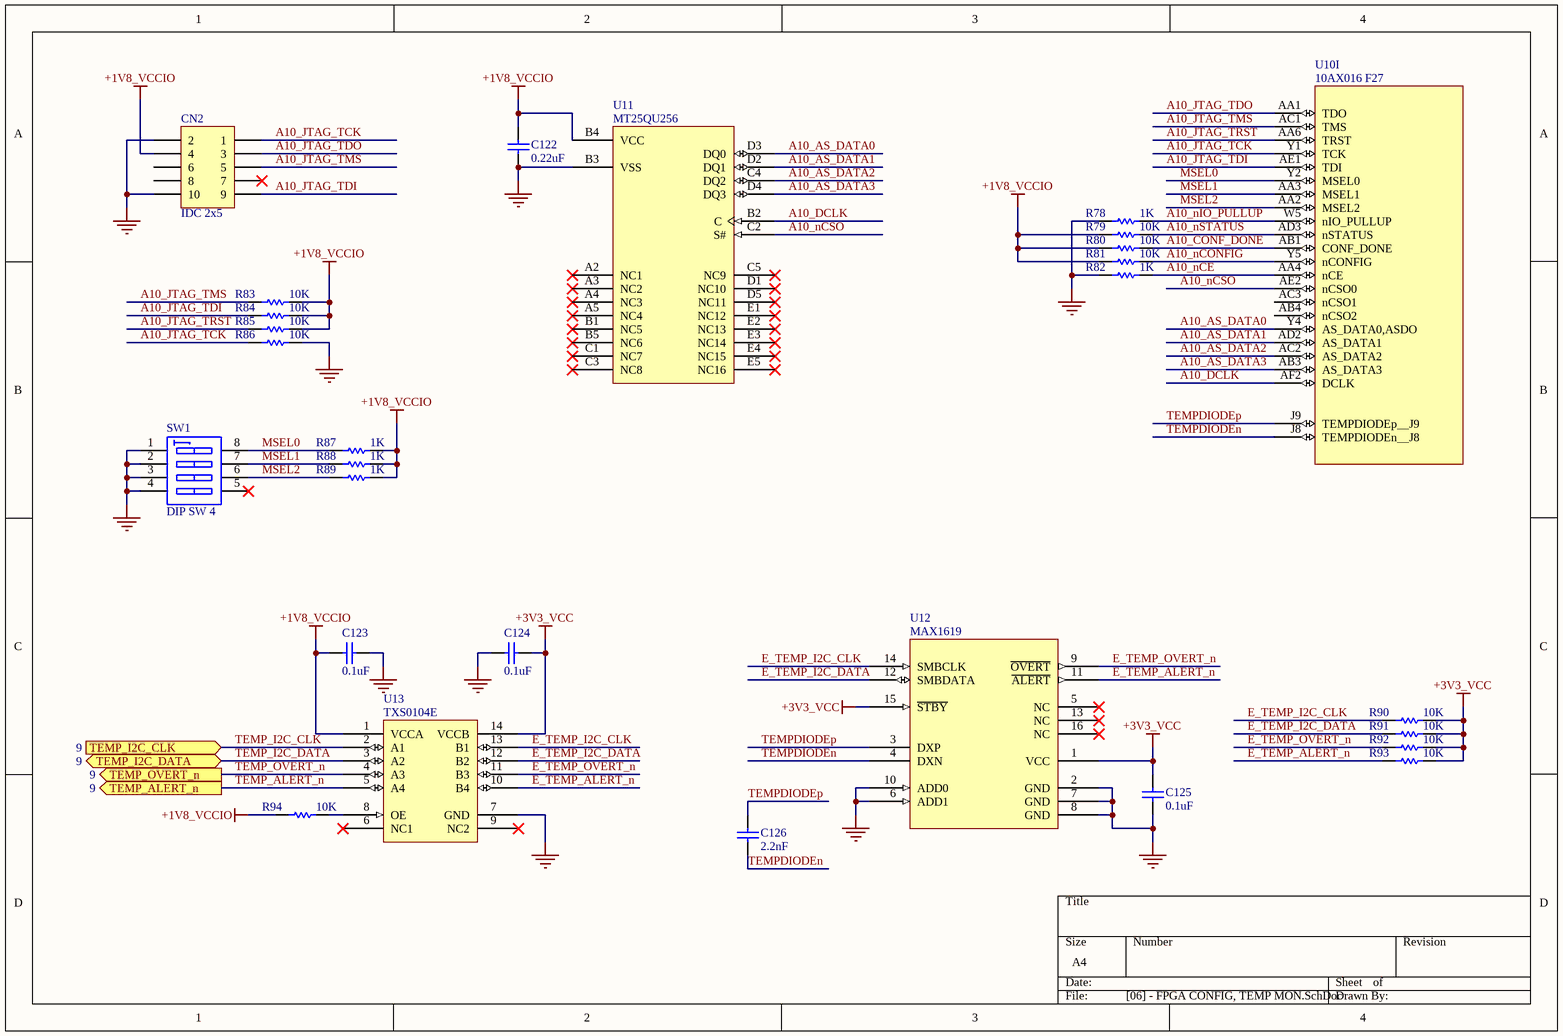
[diagram p5: [06] - FPGA CONFIG, TEMP MON.SchDoc]

### Parts
C122  0.22uF  [0402_C]
C123  0.1uF  [0805_C]
C124  0.1uF  [0805_C]
C125  0.1uF  [0805_C]
C126  2.2nF  [0805_C]
CN2  IDC 2x5  [IDC-BOX-2x5]
R78  1K  [0402_R]
R79  10K  [0402_R]
R80  10K  [0402_R]
R81  10K  [0402_R]
R82  1K  [0402_R]
R83  10K  [0402_R]
R84  10K  [0402_R]
R85  10K  [0402_R]
R86  10K  [0402_R]
R87  1K  [0402_R]
R88  1K  [0402_R]
R89  1K  [0402_R]
R90  10K  [0402_R]
R91  10K  [0402_R]
R92  10K  [0402_R]
R93  10K  [0402_R]
R94  10K  [0402_R]
SW1  DIP SW 4  [DIP-SW-4_1.27mm]
U10  10AX016 F27  [FBGA672]  (part I of 12)
U11  MT25QU256
U12  MAX1619
U13  TXS0104E

### Ports
TEMP_ALERT_n (out, see 9), TEMP_I2C_CLK (in, see 9), TEMP_I2C_DATA (bidir, see 9), TEMP_OVERT_n (out, see 9)

### Nets
+1V8_VCCIO: C122.2 C123.2 CN2.4 R79.1 R80.1 R81.1 R83.2 R84.2 R85.2 R87.2 R88.2 R89.2 R94.1 U11.B4(VCC) U13.1(VCCA)
+3V3_VCC: C124.1 C125.2 R90.2 R91.2 R92.2 R93.2 U12.1(VCC) U12.15(~{STBY}) U13.14(VCCB)
GND: C122.1 C123.1 C124.2 C125.1 CN2.2 CN2.10 R78.1 R82.1 R86.2 SW1.1(A1) SW1.2(A2) SW1.3(A3) SW1.4(A4) U11.B3(VSS) U12.2(GND) U12.6(ADD1) U12.7(GND) U12.8(GND) U12.10(ADD0) U13.7(GND)
A10_AS_DATA0: U10.Y4(AS_DATA0,ASDO) U11.D3(DQ0)
A10_AS_DATA1: U10.AD2(AS_DATA1) U11.D2(DQ1)
A10_AS_DATA2: U10.AC2(AS_DATA2) U11.C4(DQ2)
A10_AS_DATA3: U10.AB3(AS_DATA3) U11.D4(DQ3)
A10_CONF_DONE: R80.2 U10.AB1(CONF_DONE)
A10_DCLK: U10.AF2(DCLK) U11.B2(C)
A10_JTAG_TCK: CN2.1 R86.1 U10.Y1(TCK)
A10_JTAG_TDI: CN2.9 R84.1 U10.AE1(TDI)
A10_JTAG_TDO: CN2.3 U10.AA1(TDO)
A10_JTAG_TMS: CN2.5 R83.1 U10.AC1(TMS)
A10_JTAG_TRST: R85.1 U10.AA6(TRST)
A10_nCE: R82.2 U10.AA4(nCE)
A10_nCONFIG: R81.2 U10.Y5(nCONFIG)
A10_nCSO: U10.AE2(nCSO0) U11.C2(S#)
A10_nIO_PULLUP: R78.2 U10.W5(nIO_PULLUP)
A10_nSTATUS: R79.2 U10.AD3(nSTATUS)
E_TEMP_ALERT_n: R93.1 U12.11(~{ALERT}) U13.10(B4)
E_TEMP_I2C_CLK: R90.1 U12.14(SMBCLK) U13.13(B1)
E_TEMP_I2C_DATA: R91.1 U12.12(SMBDATA) U13.12(B2)
E_TEMP_OVERT_n: R92.1 U12.9(~{OVERT}) U13.11(B3)
MSEL0: R87.1 SW1.8(B3) U10.Y2(MSEL0)
MSEL1: R88.1 SW1.7(B4) U10.AA3(MSEL1)
MSEL2: R89.1 SW1.6(B5) U10.AA2(MSEL2)
TEMP_ALERT_n: U13.5(A4) ; port TEMP_ALERT_n
TEMP_I2C_CLK: U13.2(A1) ; port TEMP_I2C_CLK
TEMP_I2C_DATA: U13.3(A2) ; port TEMP_I2C_DATA
TEMP_OVERT_n: U13.4(A3) ; port TEMP_OVERT_n
TEMPDIODEn: C126.1 U10.J8(TEMPDIODEn__J8) U12.4(DXN)
TEMPDIODEp: C126.2 U10.J9(TEMPDIODEp__J9) U12.3(DXP)
NetR94_2: R94.2 U13.8(OE)

Not connected (* = marked no-connect by the designer): CN2 6 7* 8; SW1 5(A5)*; U10 AB4(nCSO2) AC3(nCSO1); U11 A2(NC1)* A3(NC2)* A4(NC3)* A5(NC4)* B1(NC5)* B5(NC6)* C1(NC7)* C3(NC8)* C5(NC9)* D1(NC10)* D5(NC11)* E1(NC12)* E2(NC13)* E3(NC14)* E4(NC15)* E5(NC16)*; U12 5(NC)* 13(NC)* 16(NC)*; U13 6(NC1)* 9(NC2)*

### Library data of the parts
C122-C126 = Cap SMD: as C1 on sheet [01] - PWR 0V9, PWR SEQ; Manufacturer Part Num: *; Dielectric: *
  C122: Value: 0.22uF
  C123-C125: Value: 0.1uF
  C126: Value: 2.2nF
CN2 = IDC 2x5: IDC Box, 5-Pin, Dual row; Value: IDC 2x5
R78-R94 = Res SMD: SMD Resistor; Tolerance: 5%; Manufacturer Part Num: *
  R78 R82 R87-R89: Value: 1K
  R79-R81 R83-R86 R90-R94: Value: 10K
SW1 = DIP SW-4: DIP Switch, 4 Position, SPST; Manufacturer Part Num: GDH04S04; Value: DIP SW 4
U10 = 10AX016: Value: 10AX016 F27; Manufacturer Part Num: *
U11 = MT25QU: Micron Serial NOR Flash Memory; Manufacturer Part Num: MT25QU256ABA8E12-1SIT; Value: MT25QU256
U12 = MAX1619: Remote/Local Temperature Sensor; Value: MAX1619; Manufacturer Part Num: *
U13 = TXS0104E: 4-Bit Bidirectional Voltage-Level Translator for Open-Drain and Push-Pull Applications; Value: TXS0104E; Manufacturer Part Num: *

## Sheet [07] - FPGA XCVR.SchDoc
size A3; DocumentNumber: 7; SheetNumber: 7; SheetTotal: 15
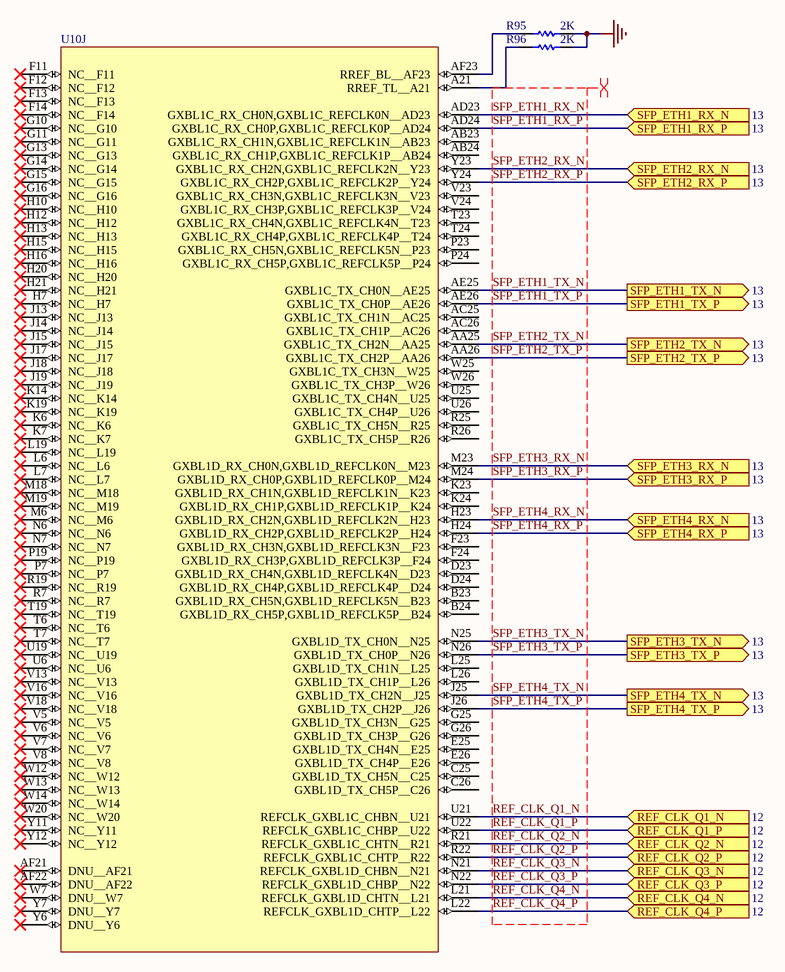
[diagram p6: [07] - FPGA XCVR.SchDoc]

### Parts
R95  2K  [0402_R]
R96  2K  [0402_R]
U10  10AX016 F27  [FBGA672]  (value not drawn)  (part J of 12)

### Ports
REF_CLK_Q1_N (in, see 12), REF_CLK_Q1_P (in, see 12), REF_CLK_Q2_N (in, see 12), REF_CLK_Q2_P (in, see 12), REF_CLK_Q3_N (in, see 12), REF_CLK_Q3_P (in, see 12), REF_CLK_Q4_N (in, see 12), REF_CLK_Q4_P (in, see 12), SFP_ETH1_RX_N (in, see 13), SFP_ETH1_RX_P (in, see 13), SFP_ETH1_TX_N (out, see 13), SFP_ETH1_TX_P (out, see 13), SFP_ETH2_RX_N (in, see 13), SFP_ETH2_RX_P (in, see 13), SFP_ETH2_TX_N (out, see 13), SFP_ETH2_TX_P (out, see 13), SFP_ETH3_RX_N (in, see 13), SFP_ETH3_RX_P (in, see 13), SFP_ETH3_TX_N (out, see 13), SFP_ETH3_TX_P (out, see 13), SFP_ETH4_RX_N (in, see 13), SFP_ETH4_RX_P (in, see 13), SFP_ETH4_TX_N (out, see 13), SFP_ETH4_TX_P (out, see 13)

### Nets
GND: R95.2 R96.2
REF_CLK_Q1_N: U10.U21(REFCLK_GXBL1C_CHBN__U21) ; port REF_CLK_Q1_N
REF_CLK_Q1_P: U10.U22(REFCLK_GXBL1C_CHBP__U22) ; port REF_CLK_Q1_P
REF_CLK_Q2_N: U10.R21(REFCLK_GXBL1C_CHTN__R21) ; port REF_CLK_Q2_N
REF_CLK_Q2_P: U10.R22(REFCLK_GXBL1C_CHTP__R22) ; port REF_CLK_Q2_P
REF_CLK_Q3_N: U10.N21(REFCLK_GXBL1D_CHBN__N21) ; port REF_CLK_Q3_N
REF_CLK_Q3_P: U10.N22(REFCLK_GXBL1D_CHBP__N22) ; port REF_CLK_Q3_P
REF_CLK_Q4_N: U10.L21(REFCLK_GXBL1D_CHTN__L21) ; port REF_CLK_Q4_N
REF_CLK_Q4_P: U10.L22(REFCLK_GXBL1D_CHTP__L22) ; port REF_CLK_Q4_P
SFP_ETH1_RX_N: U10.AD23(GXBL1C_RX_CH0N,GXBL1C_REFCLK0N__AD23) ; port SFP_ETH1_RX_N
SFP_ETH1_RX_P: U10.AD24(GXBL1C_RX_CH0P,GXBL1C_REFCLK0P__AD24) ; port SFP_ETH1_RX_P
SFP_ETH1_TX_N: U10.AE25(GXBL1C_TX_CH0N__AE25) ; port SFP_ETH1_TX_N
SFP_ETH1_TX_P: U10.AE26(GXBL1C_TX_CH0P__AE26) ; port SFP_ETH1_TX_P
SFP_ETH2_RX_N: U10.Y23(GXBL1C_RX_CH2N,GXBL1C_REFCLK2N__Y23) ; port SFP_ETH2_RX_N
SFP_ETH2_RX_P: U10.Y24(GXBL1C_RX_CH2P,GXBL1C_REFCLK2P__Y24) ; port SFP_ETH2_RX_P
SFP_ETH2_TX_N: U10.AA25(GXBL1C_TX_CH2N__AA25) ; port SFP_ETH2_TX_N
SFP_ETH2_TX_P: U10.AA26(GXBL1C_TX_CH2P__AA26) ; port SFP_ETH2_TX_P
SFP_ETH3_RX_N: U10.M23(GXBL1D_RX_CH0N,GXBL1D_REFCLK0N__M23) ; port SFP_ETH3_RX_N
SFP_ETH3_RX_P: U10.M24(GXBL1D_RX_CH0P,GXBL1D_REFCLK0P__M24) ; port SFP_ETH3_RX_P
SFP_ETH3_TX_N: U10.N25(GXBL1D_TX_CH0N__N25) ; port SFP_ETH3_TX_N
SFP_ETH3_TX_P: U10.N26(GXBL1D_TX_CH0P__N26) ; port SFP_ETH3_TX_P
SFP_ETH4_RX_N: U10.H23(GXBL1D_RX_CH2N,GXBL1D_REFCLK2N__H23) ; port SFP_ETH4_RX_N
SFP_ETH4_RX_P: U10.H24(GXBL1D_RX_CH2P,GXBL1D_REFCLK2P__H24) ; port SFP_ETH4_RX_P
SFP_ETH4_TX_N: U10.J25(GXBL1D_TX_CH2N__J25) ; port SFP_ETH4_TX_N
SFP_ETH4_TX_P: U10.J26(GXBL1D_TX_CH2P__J26) ; port SFP_ETH4_TX_P
NetR95_1: R95.1 U10.AF23(RREF_BL__AF23)
NetR96_1: R96.1 U10.A21(RREF_TL__A21)

Not connected (* = marked no-connect by the designer): U10 AB23(GXBL1C_RX_CH1N,GXBL1C_REFCLK1N__AB23) AB24(GXBL1C_RX_CH1P,GXBL1C_REFCLK1P__AB24) AC25(GXBL1C_TX_CH1N__AC25) AC26(GXBL1C_TX_CH1P__AC26) AF21(DNU__AF21)* AF22(DNU__AF22)* B23(GXBL1D_RX_CH5N,GXBL1D_REFCLK5N__B23) B24(GXBL1D_RX_CH5P,GXBL1D_REFCLK5P__B24) C25(GXBL1D_TX_CH5N__C25) C26(GXBL1D_TX_CH5P__C26) D23(GXBL1D_RX_CH4N,GXBL1D_REFCLK4N__D23) D24(GXBL1D_RX_CH4P,GXBL1D_REFCLK4P__D24) E25(GXBL1D_TX_CH4N__E25) E26(GXBL1D_TX_CH4P__E26) F11(NC__F11)* F12(NC__F12)* F13(NC__F13)* F14(NC__F14)* F23(GXBL1D_RX_CH3N,GXBL1D_REFCLK3N__F23) F24(GXBL1D_RX_CH3P,GXBL1D_REFCLK3P__F24) G10(NC__G10)* G11(NC__G11)* G13(NC__G13)* G14(NC__G14)* G15(NC__G15)* G16(NC__G16)* G25(GXBL1D_TX_CH3N__G25) G26(GXBL1D_TX_CH3P__G26) H7(NC__H7)* H10(NC__H10)* H12(NC__H12)* H13(NC__H13)* H15(NC__H15)* H16(NC__H16)* H20(NC__H20)* H21(NC__H21)* J13(NC__J13)* J14(NC__J14)* J15(NC__J15)* J17(NC__J17)* J18(NC__J18)* J19(NC__J19)* K6(NC__K6)* K7(NC__K7)* K14(NC__K14)* K19(NC__K19)* K23(GXBL1D_RX_CH1N,GXBL1D_REFCLK1N__K23) K24(GXBL1D_RX_CH1P,GXBL1D_REFCLK1P__K24) L6(NC__L6)* L7(NC__L7)* L19(NC__L19)* L25(GXBL1D_TX_CH1N__L25) L26(GXBL1D_TX_CH1P__L26) M6(NC__M6)* M18(NC__M18)* M19(NC__M19)* N6(NC__N6)* N7(NC__N7)* P7(NC__P7)* P19(NC__P19)* P23(GXBL1C_RX_CH5N,GXBL1C_REFCLK5N__P23) P24(GXBL1C_RX_CH5P,GXBL1C_REFCLK5P__P24) R7(NC__R7)* R19(NC__R19)* R25(GXBL1C_TX_CH5N__R25) R26(GXBL1C_TX_CH5P__R26) T6(NC__T6)* T7(NC__T7)* T19(NC__T19)* T23(GXBL1C_RX_CH4N,GXBL1C_REFCLK4N__T23) T24(GXBL1C_RX_CH4P,GXBL1C_REFCLK4P__T24) U6(NC__U6)* U19(NC__U19)* U25(GXBL1C_TX_CH4N__U25) U26(GXBL1C_TX_CH4P__U26) V5(NC__V5)* V6(NC__V6)* V7(NC__V7)* V8(NC__V8)* V13(NC__V13)* V16(NC__V16)* V18(NC__V18)* V23(GXBL1C_RX_CH3N,GXBL1C_REFCLK3N__V23) V24(GXBL1C_RX_CH3P,GXBL1C_REFCLK3P__V24) W7(DNU__W7)* W12(NC__W12)* W13(NC__W13)* W14(NC__W14)* W20(NC__W20)* W25(GXBL1C_TX_CH3N__W25) W26(GXBL1C_TX_CH3P__W26) Y6(DNU__Y6)* Y7(DNU__Y7)* Y11(NC__Y11)* Y12(NC__Y12)*

### Layout directives
differential pair; differential pair class DIFF100: REF_CLK_Q1_N, REF_CLK_Q1_P, REF_CLK_Q2_N, REF_CLK_Q2_P, REF_CLK_Q3_N, REF_CLK_Q3_P, REF_CLK_Q4_N, REF_CLK_Q4_P, SFP_ETH1_RX_N, SFP_ETH1_RX_P, SFP_ETH1_TX_N, SFP_ETH1_TX_P, SFP_ETH2_RX_N, SFP_ETH2_RX_P, SFP_ETH2_TX_N, SFP_ETH2_TX_P, SFP_ETH3_RX_N, SFP_ETH3_RX_P, SFP_ETH3_TX_N, SFP_ETH3_TX_P, SFP_ETH4_RX_N, SFP_ETH4_RX_P, SFP_ETH4_TX_N, SFP_ETH4_TX_P

### Library data of the parts
R95 R96 = Res SMD: SMD Resistor; Tolerance: 1%; Value: 2K; Manufacturer Part Num: *
U10 = 10AX016: Value: 10AX016 F27; Manufacturer Part Num: *

## Sheet [08] - FPGA - DDR3.SchDoc
size A2; DocumentNumber: 8; SheetNumber: 8; SheetTotal: 15
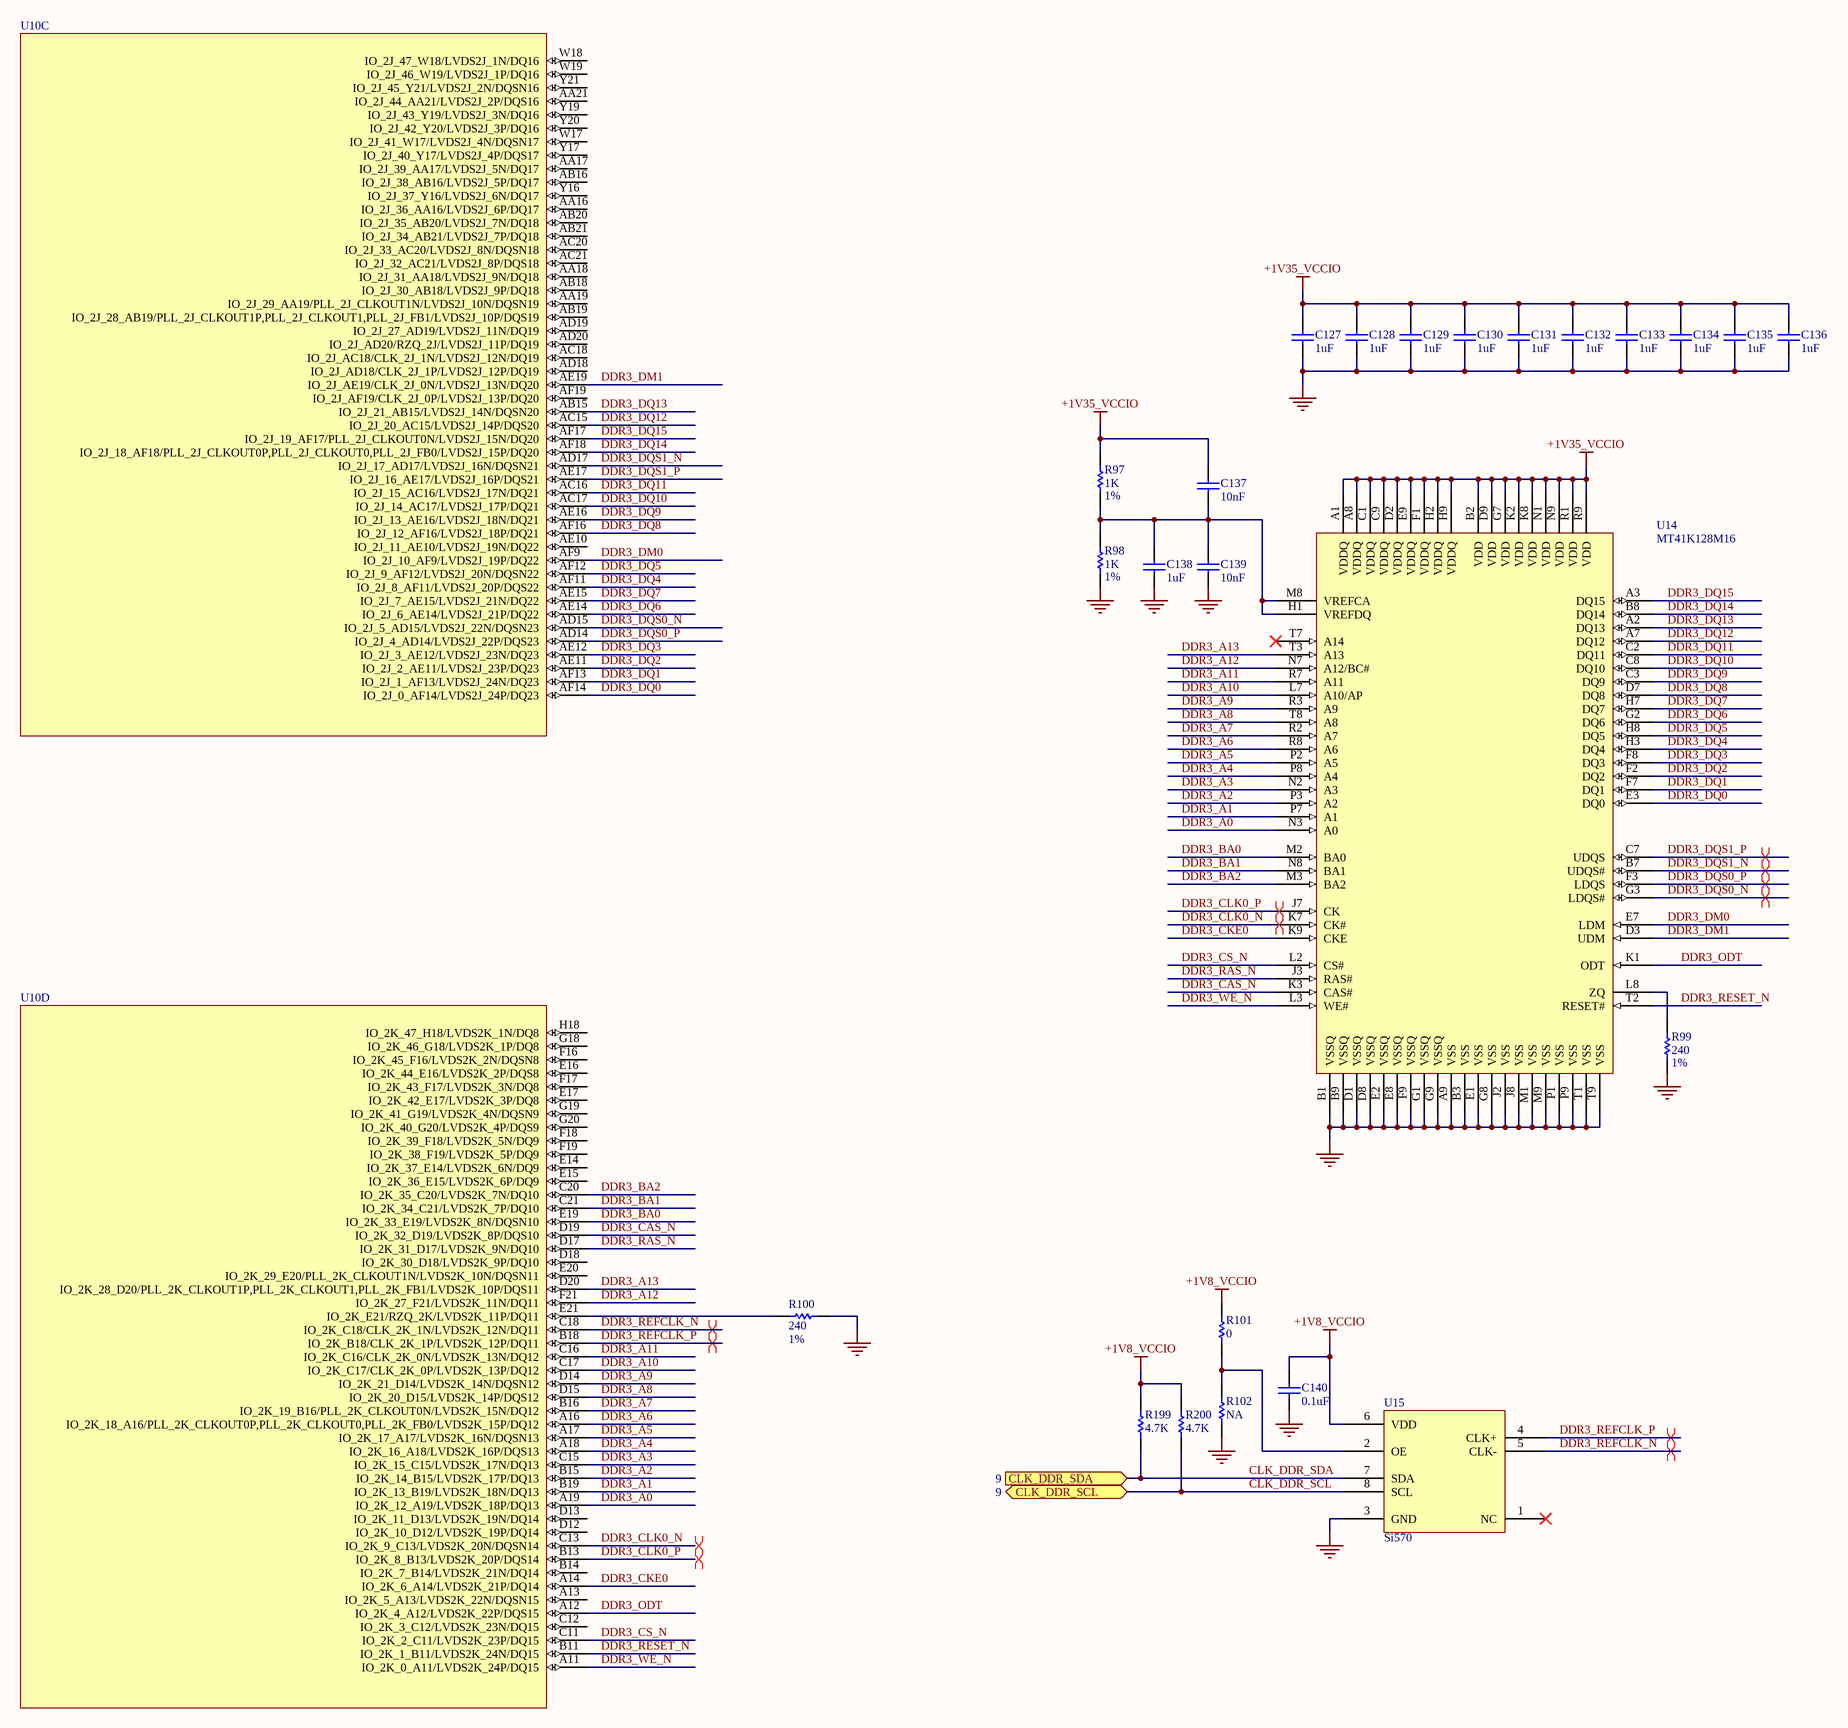
[diagram p7: [08] - FPGA - DDR3.SchDoc]

### Parts
C127  1uF  [0402_C]
C128  1uF  [0402_C]
C129  1uF  [0402_C]
C130  1uF  [0402_C]
C131  1uF  [0402_C]
C132  1uF  [0402_C]
C133  1uF  [0402_C]
C134  1uF  [0402_C]
C135  1uF  [0402_C]
C136  1uF  [0402_C]
C137  10nF  [0402_C]
C138  1uF  [0805_C]
C139  10nF  [0402_C]
C140  0.1uF  [0402_C]
R97  1K  Tolerance: 1%  [0402_R]
R98  1K  Tolerance: 1%  [0402_R]
R99  240  Tolerance: 1%  [0402_R]
R100  240  Tolerance: 1%  [0402_R]
R101  0  [0402_R]
R102  NA  [0402_R]
R199  4.7K  [0402_R]
R200  4.7K  [0402_R]
U10  10AX016 F27  [FBGA672]  (value not drawn)  (parts C,D of 12)
U14  MT41K128M16  [FBGA96]
U15  Si570

### Ports
CLK_DDR_SCL (bidir, see 9), CLK_DDR_SDA (in, see 9)

### Nets
+1V8_VCCIO: C140.1 R101.2 R199.2 R200.2 U15.6(VDD)
+1V35_VCCIO: C127.2 C128.2 C129.2 C130.2 C131.2 C132.2 C133.2 C134.2 C135.2 C136.2 C137.2 R97.2 U14.A1(VDDQ) U14.A8(VDDQ) U14.B2(VDD) U14.C1(VDDQ) U14.C9(VDDQ) U14.D2(VDDQ) U14.D9(VDD) U14.E9(VDDQ) U14.F1(VDDQ) U14.G7(VDD) U14.H2(VDDQ) U14.H9(VDDQ) U14.K2(VDD) U14.K8(VDD) U14.N1(VDD) U14.N9(VDD) U14.R1(VDD) U14.R9(VDD)
GND: C127.1 C128.1 C129.1 C130.1 C131.1 C132.1 C133.1 C134.1 C135.1 C136.1 C138.1 C139.1 C140.2 R98.1 R99.1 R100.1 R102.1 U14.A9(VSS) U14.B1(VSSQ) U14.B3(VSS) U14.B9(VSSQ) U14.D1(VSSQ) U14.D8(VSSQ) U14.E1(VSS) U14.E2(VSSQ) U14.E8(VSSQ) U14.F9(VSSQ) U14.G1(VSSQ) U14.G8(VSS) U14.G9(VSSQ) U14.J2(VSS) U14.J8(VSS) U14.M1(VSS) U14.M9(VSS) U14.P1(VSS) U14.P9(VSS) U14.T1(VSS) U14.T9(VSS) U15.3(GND)
CLK_DDR_SCL: R200.1 U15.8(SCL) ; port CLK_DDR_SCL
CLK_DDR_SDA: R199.1 U15.7(SDA) ; port CLK_DDR_SDA
DDR3_A0: U10.A19(IO_2K_12_A19/LVDS2K_18P/DQ13) U14.N3(A0)
DDR3_A1: U10.B19(IO_2K_13_B19/LVDS2K_18N/DQ13) U14.P7(A1)
DDR3_A2: U10.B15(IO_2K_14_B15/LVDS2K_17P/DQ13) U14.P3(A2)
DDR3_A3: U10.C15(IO_2K_15_C15/LVDS2K_17N/DQ13) U14.N2(A3)
DDR3_A4: U10.A18(IO_2K_16_A18/LVDS2K_16P/DQS13) U14.P8(A4)
DDR3_A5: U10.A17(IO_2K_17_A17/LVDS2K_16N/DQSN13) U14.P2(A5)
DDR3_A6: U10.A16(IO_2K_18_A16/PLL_2K_CLKOUT0P,PLL_2K_CLKOUT0,PLL_2K_FB0/LVDS2K_15P/DQ12) U14.R8(A6)
DDR3_A7: U10.B16(IO_2K_19_B16/PLL_2K_CLKOUT0N/LVDS2K_15N/DQ12) U14.R2(A7)
DDR3_A8: U10.D15(IO_2K_20_D15/LVDS2K_14P/DQS12) U14.T8(A8)
DDR3_A9: U10.D14(IO_2K_21_D14/LVDS2K_14N/DQSN12) U14.R3(A9)
DDR3_A10: U10.C17(IO_2K_C17/CLK_2K_0P/LVDS2K_13P/DQ12) U14.L7(A10/AP)
DDR3_A11: U10.C16(IO_2K_C16/CLK_2K_0N/LVDS2K_13N/DQ12) U14.R7(A11)
DDR3_A12: U10.F21(IO_2K_27_F21/LVDS2K_11N/DQ11) U14.N7(A12/BC#)
DDR3_A13: U10.D20(IO_2K_28_D20/PLL_2K_CLKOUT1P,PLL_2K_CLKOUT1,PLL_2K_FB1/LVDS2K_10P/DQS11) U14.T3(A13)
DDR3_BA0: U10.E19(IO_2K_33_E19/LVDS2K_8N/DQSN10) U14.M2(BA0)
DDR3_BA1: U10.C21(IO_2K_34_C21/LVDS2K_7P/DQ10) U14.N8(BA1)
DDR3_BA2: U10.C20(IO_2K_35_C20/LVDS2K_7N/DQ10) U14.M3(BA2)
DDR3_CAS_N: U10.D19(IO_2K_32_D19/LVDS2K_8P/DQS10) U14.K3(CAS#)
DDR3_CKE0: U10.A14(IO_2K_6_A14/LVDS2K_21P/DQ14) U14.K9(CKE)
DDR3_CLK0_N: U10.C13(IO_2K_9_C13/LVDS2K_20N/DQSN14) U14.K7(CK#)
DDR3_CLK0_P: U10.B13(IO_2K_8_B13/LVDS2K_20P/DQS14) U14.J7(CK)
DDR3_CS_N: U10.C11(IO_2K_2_C11/LVDS2K_23P/DQ15) U14.L2(CS#)
DDR3_DM0: U10.AF9(IO_2J_10_AF9/LVDS2J_19P/DQ22) U14.E7(LDM)
DDR3_DM1: U10.AE19(IO_2J_AE19/CLK_2J_0N/LVDS2J_13N/DQ20) U14.D3(UDM)
DDR3_DQ0: U10.AF14(IO_2J_0_AF14/LVDS2J_24P/DQ23) U14.E3(DQ0)
DDR3_DQ1: U10.AF13(IO_2J_1_AF13/LVDS2J_24N/DQ23) U14.F7(DQ1)
DDR3_DQ2: U10.AE11(IO_2J_2_AE11/LVDS2J_23P/DQ23) U14.F2(DQ2)
DDR3_DQ3: U10.AE12(IO_2J_3_AE12/LVDS2J_23N/DQ23) U14.F8(DQ3)
DDR3_DQ4: U10.AF11(IO_2J_8_AF11/LVDS2J_20P/DQS22) U14.H3(DQ4)
DDR3_DQ5: U10.AF12(IO_2J_9_AF12/LVDS2J_20N/DQSN22) U14.H8(DQ5)
DDR3_DQ6: U10.AE14(IO_2J_6_AE14/LVDS2J_21P/DQ22) U14.G2(DQ6)
DDR3_DQ7: U10.AE15(IO_2J_7_AE15/LVDS2J_21N/DQ22) U14.H7(DQ7)
DDR3_DQ8: U10.AF16(IO_2J_12_AF16/LVDS2J_18P/DQ21) U14.D7(DQ8)
DDR3_DQ9: U10.AE16(IO_2J_13_AE16/LVDS2J_18N/DQ21) U14.C3(DQ9)
DDR3_DQ10: U10.AC17(IO_2J_14_AC17/LVDS2J_17P/DQ21) U14.C8(DQ10)
DDR3_DQ11: U10.AC16(IO_2J_15_AC16/LVDS2J_17N/DQ21) U14.C2(DQ11)
DDR3_DQ12: U10.AC15(IO_2J_20_AC15/LVDS2J_14P/DQS20) U14.A7(DQ12)
DDR3_DQ13: U10.AB15(IO_2J_21_AB15/LVDS2J_14N/DQSN20) U14.A2(DQ13)
DDR3_DQ14: U10.AF18(IO_2J_18_AF18/PLL_2J_CLKOUT0P,PLL_2J_CLKOUT0,PLL_2J_FB0/LVDS2J_15P/DQ20) U14.B8(DQ14)
DDR3_DQ15: U10.AF17(IO_2J_19_AF17/PLL_2J_CLKOUT0N/LVDS2J_15N/DQ20) U14.A3(DQ15)
DDR3_DQS0_N: U10.AD15(IO_2J_5_AD15/LVDS2J_22N/DQSN23) U14.G3(LDQS#)
DDR3_DQS0_P: U10.AD14(IO_2J_4_AD14/LVDS2J_22P/DQS23) U14.F3(LDQS)
DDR3_DQS1_N: U10.AD17(IO_2J_17_AD17/LVDS2J_16N/DQSN21) U14.B7(UDQS#)
DDR3_DQS1_P: U10.AE17(IO_2J_16_AE17/LVDS2J_16P/DQS21) U14.C7(UDQS)
DDR3_ODT: U10.A12(IO_2K_4_A12/LVDS2K_22P/DQS15) U14.K1(ODT)
DDR3_RAS_N: U10.D17(IO_2K_31_D17/LVDS2K_9N/DQ10) U14.J3(RAS#)
DDR3_REFCLK_N: U10.C18(IO_2K_C18/CLK_2K_1N/LVDS2K_12N/DQ11) U15.5(CLK-)
DDR3_REFCLK_P: U10.B18(IO_2K_B18/CLK_2K_1P/LVDS2K_12P/DQ11) U15.4(CLK+)
DDR3_RESET_N: U10.B11(IO_2K_1_B11/LVDS2K_24N/DQ15) U14.T2(RESET#)
DDR3_WE_N: U10.A11(IO_2K_0_A11/LVDS2K_24P/DQ15) U14.L3(WE#)
NetC137_1: C137.1 C138.2 C139.2 R97.1 R98.2 U14.H1(VREFDQ) U14.M8(VREFCA)
NetR99_2: R99.2 U14.L8(ZQ)
NetR100_2: R100.2 U10.E21(IO_2K_E21/RZQ_2K/LVDS2K_11P/DQ11)
NetR101_1: R101.1 R102.2 U15.2(OE)

Not connected (* = marked no-connect by the designer): U10 A13(IO_2K_5_A13/LVDS2K_22N/DQSN15) AA16(IO_2J_36_AA16/LVDS2J_6P/DQ17) AA17(IO_2J_39_AA17/LVDS2J_5N/DQ17) AA18(IO_2J_31_AA18/LVDS2J_9N/DQ18) AA19(IO_2J_29_AA19/PLL_2J_CLKOUT1N/LVDS2J_10N/DQSN19) AA21(IO_2J_44_AA21/LVDS2J_2P/DQS16) AB16(IO_2J_38_AB16/LVDS2J_5P/DQ17) AB18(IO_2J_30_AB18/LVDS2J_9P/DQ18) AB19(IO_2J_28_AB19/PLL_2J_CLKOUT1P,PLL_2J_CLKOUT1,PLL_2J_FB1/LVDS2J_10P/DQS19) AB20(IO_2J_35_AB20/LVDS2J_7N/DQ18) AB21(IO_2J_34_AB21/LVDS2J_7P/DQ18) AC18(IO_2J_AC18/CLK_2J_1N/LVDS2J_12N/DQ19) AC20(IO_2J_33_AC20/LVDS2J_8N/DQSN18) AC21(IO_2J_32_AC21/LVDS2J_8P/DQS18) AD18(IO_2J_AD18/CLK_2J_1P/LVDS2J_12P/DQ19) AD19(IO_2J_27_AD19/LVDS2J_11N/DQ19) AD20(IO_2J_AD20/RZQ_2J/LVDS2J_11P/DQ19) AE10(IO_2J_11_AE10/LVDS2J_19N/DQ22) AF19(IO_2J_AF19/CLK_2J_0P/LVDS2J_13P/DQ20) B14(IO_2K_7_B14/LVDS2K_21N/DQ14) C12(IO_2K_3_C12/LVDS2K_23N/DQ15) D12(IO_2K_10_D12/LVDS2K_19P/DQ14) D13(IO_2K_11_D13/LVDS2K_19N/DQ14) D18(IO_2K_30_D18/LVDS2K_9P/DQ10) E14(IO_2K_37_E14/LVDS2K_6N/DQ9) E15(IO_2K_36_E15/LVDS2K_6P/DQ9) E16(IO_2K_44_E16/LVDS2K_2P/DQS8) E17(IO_2K_42_E17/LVDS2K_3P/DQ8) E20(IO_2K_29_E20/PLL_2K_CLKOUT1N/LVDS2K_10N/DQSN11) F16(IO_2K_45_F16/LVDS2K_2N/DQSN8) F17(IO_2K_43_F17/LVDS2K_3N/DQ8) F18(IO_2K_39_F18/LVDS2K_5N/DQ9) F19(IO_2K_38_F19/LVDS2K_5P/DQ9) G18(IO_2K_46_G18/LVDS2K_1P/DQ8) G19(IO_2K_41_G19/LVDS2K_4N/DQSN9) G20(IO_2K_40_G20/LVDS2K_4P/DQS9) H18(IO_2K_47_H18/LVDS2K_1N/DQ8) W17(IO_2J_41_W17/LVDS2J_4N/DQSN17) W18(IO_2J_47_W18/LVDS2J_1N/DQ16) W19(IO_2J_46_W19/LVDS2J_1P/DQ16) Y16(IO_2J_37_Y16/LVDS2J_6N/DQ17) Y17(IO_2J_40_Y17/LVDS2J_4P/DQS17) Y19(IO_2J_43_Y19/LVDS2J_3N/DQ16) Y20(IO_2J_42_Y20/LVDS2J_3P/DQ16) Y21(IO_2J_45_Y21/LVDS2J_2N/DQSN16); U14 T7(A14)*; U15 1(NC)*

### Layout directives
differential pair; differential pair class DIFF100: DDR3_CLK0_N, DDR3_CLK0_P, DDR3_DQS0_N, DDR3_DQS0_P, DDR3_DQS1_N, DDR3_DQS1_P
differential pair: DDR3_REFCLK_N, DDR3_REFCLK_P

### Library data of the parts
C127-C136 = Cap SMD: Non-Pol SMD Capacitor; Manufacturer Part Num: GRM155R70J105KA12; RATED_VOLTAGE: 6.3V; Dielectric: X7R; Value: 1uF
C137-C140 = Cap SMD: as C4 on sheet [01] - PWR 0V9, PWR SEQ; Manufacturer Part Num: *; Dielectric: *
  C137 C139: Value: 10nF
  C138: Value: 1uF
  C140: Value: 0.1uF
R97-R100 = Res SMD: SMD Resistor; Manufacturer Part Num: *
  R97 R98: Value: 1K
  R99 R100: Value: 240
R101 R102 R199 R200 = Res SMD: SMD Resistor; Tolerance: 5%; Manufacturer Part Num: *
  R101: Value: 0
  R102: Value: NA
  R199 R200: Value: 4.7K
U10 = 10AX016: Value: 10AX016 F27; Manufacturer Part Num: *
U14 = MT41K128M16JT: 2Gb: x16 DDR3 SDRAM; Manufacturer Part Num: MT41K128M16JT-125; Value: MT41K128M16
U15 = Si570: 10 MHZ TO 1.4 GHZ I2C PROGRAMMABLE XO/VCXO; Value: Si570; Manufacturer Part Num: *

## Sheet [09] - FPGA IO BANK 2A, 2L.SchDoc
size A3; DocumentNumber: 9; SheetNumber: 9; SheetTotal: 15
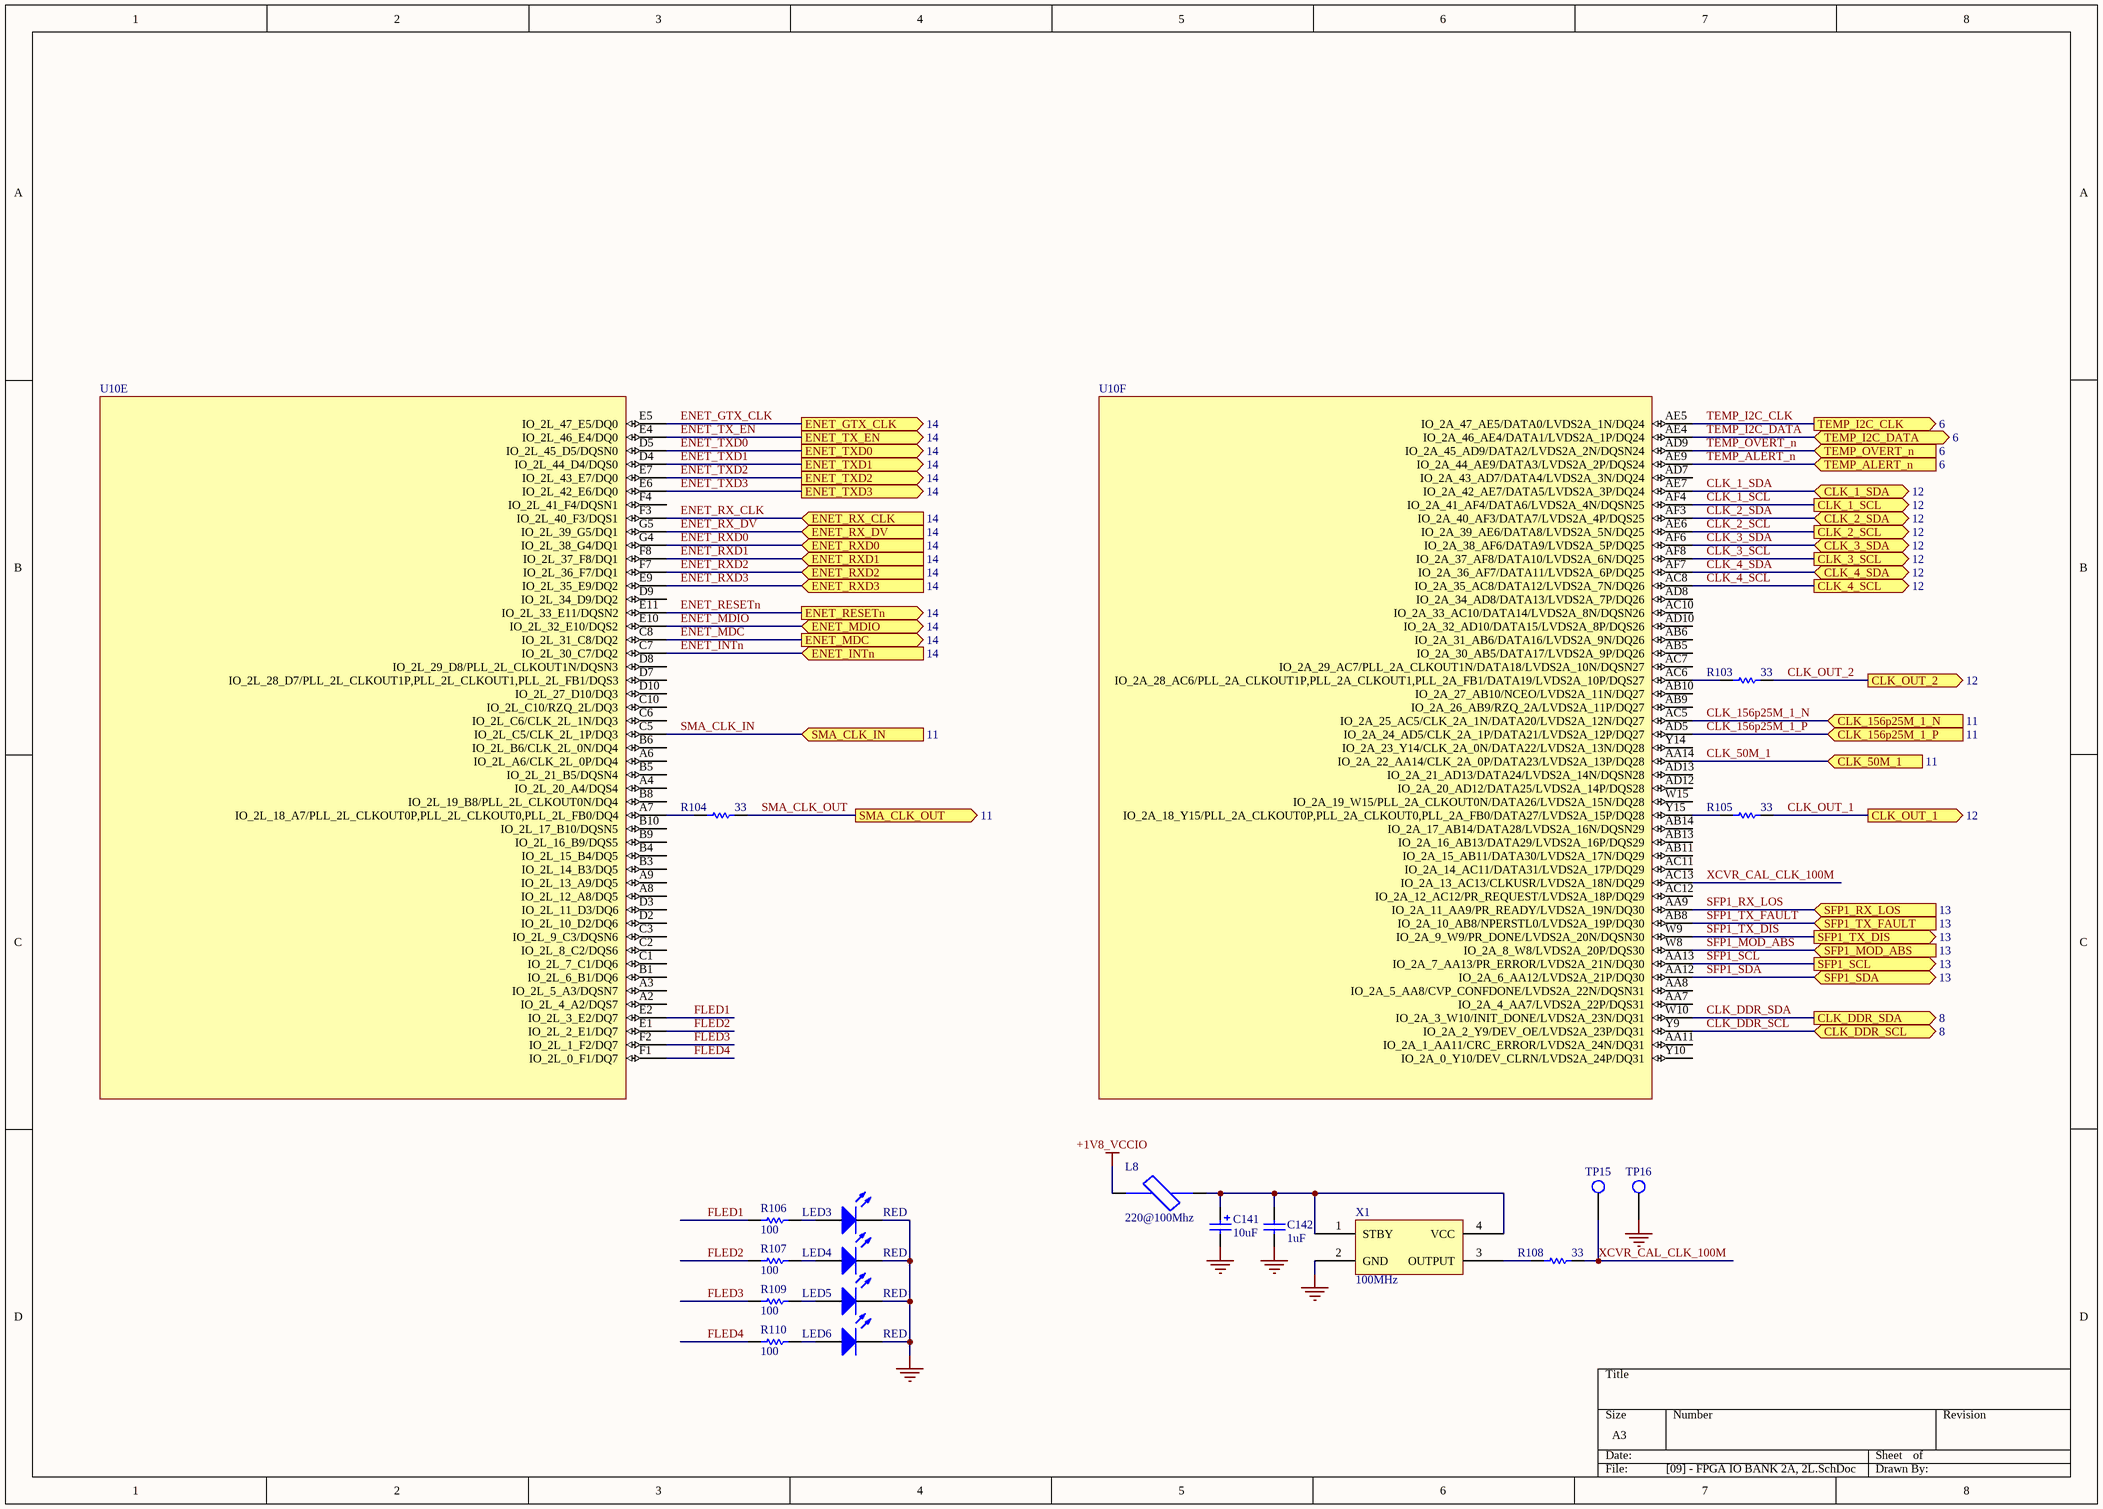
[diagram p8: [09] - FPGA IO BANK 2A, 2L.SchDoc]

### Parts
C141  10uF  [TANT_B]
C142  1uF  [0402_C]
L8  220@100Mhz  [0805_L]
LED3  RED  [LED_0805]
LED4  RED  [LED_0805]
LED5  RED  [LED_0805]
LED6  RED  [LED_0805]
R103  33  [0402_R]
R104  33  [0402_R]
R105  33  [0402_R]
R106  100  [0805_R]
R107  100  [0805_R]
R108  33  [0402_R]
R109  100  [0805_R]
R110  100  [0805_R]
TP15  Test Point  [PIN_1mm]  (value not drawn)
TP16  Test Point  [PIN_1mm]  (value not drawn)
U10  10AX016 F27  [FBGA672]  (value not drawn)  (parts E,F of 12)
X1  100MHz  [OSC_5X3.2]

### Ports
CLK_1_SCL (out, see 12), CLK_1_SDA (bidir, see 12), CLK_2_SCL (out, see 12), CLK_2_SDA (bidir, see 12), CLK_3_SCL (out, see 12), CLK_3_SDA (bidir, see 12), CLK_4_SCL (out, see 12), CLK_4_SDA (bidir, see 12), CLK_50M_1 (in, see 11), CLK_156p25M_1_N (in, see 11), CLK_156p25M_1_P (in, see 11), CLK_DDR_SCL (bidir, see 8), CLK_DDR_SDA (out, see 8), CLK_OUT_1 (out, see 12), CLK_OUT_2 (out, see 12), ENET_GTX_CLK (out, see 14), ENET_INTn (in, see 14), ENET_MDC (out, see 14), ENET_MDIO (bidir, see 14), ENET_RESETn (out, see 14), ENET_RX_CLK (in, see 14), ENET_RX_DV (in, see 14), ENET_RXD0 (in, see 14), ENET_RXD1 (in, see 14), ENET_RXD2 (in, see 14), ENET_RXD3 (in, see 14), ENET_TX_EN (out, see 14), ENET_TXD0 (out, see 14), ENET_TXD1 (out, see 14), ENET_TXD2 (out, see 14), ENET_TXD3 (out, see 14), SFP1_MOD_ABS (in, see 13), SFP1_RX_LOS (in, see 13), SFP1_SCL (out, see 13), SFP1_SDA (bidir, see 13), SFP1_TX_DIS (out, see 13), SFP1_TX_FAULT (in, see 13), SMA_CLK_IN (in, see 11), SMA_CLK_OUT (out, see 11), TEMP_ALERT_n (in, see 6), TEMP_I2C_CLK (out, see 6), TEMP_I2C_DATA (bidir, see 6), TEMP_OVERT_n (in, see 6)

### Nets
+1V8_VCCIO: L8.1
GND: C141.2 C142.1 LED3.2(K) LED4.2(K) LED5.2(K) LED6.2(K) TP16.1 X1.2(GND)
CLK_1_SCL: U10.AF4(IO_2A_41_AF4/DATA6/LVDS2A_4N/DQSN25) ; port CLK_1_SCL
CLK_1_SDA: U10.AE7(IO_2A_42_AE7/DATA5/LVDS2A_3P/DQ24) ; port CLK_1_SDA
CLK_2_SCL: U10.AE6(IO_2A_39_AE6/DATA8/LVDS2A_5N/DQ25) ; port CLK_2_SCL
CLK_2_SDA: U10.AF3(IO_2A_40_AF3/DATA7/LVDS2A_4P/DQS25) ; port CLK_2_SDA
CLK_3_SCL: U10.AF8(IO_2A_37_AF8/DATA10/LVDS2A_6N/DQ25) ; port CLK_3_SCL
CLK_3_SDA: U10.AF6(IO_2A_38_AF6/DATA9/LVDS2A_5P/DQ25) ; port CLK_3_SDA
CLK_4_SCL: U10.AC8(IO_2A_35_AC8/DATA12/LVDS2A_7N/DQ26) ; port CLK_4_SCL
CLK_4_SDA: U10.AF7(IO_2A_36_AF7/DATA11/LVDS2A_6P/DQ25) ; port CLK_4_SDA
CLK_50M_1: U10.AA14(IO_2A_22_AA14/CLK_2A_0P/DATA23/LVDS2A_13P/DQ28) ; port CLK_50M_1
CLK_156p25M_1_N: U10.AC5(IO_2A_25_AC5/CLK_2A_1N/DATA20/LVDS2A_12N/DQ27) ; port CLK_156p25M_1_N
CLK_156p25M_1_P: U10.AD5(IO_2A_24_AD5/CLK_2A_1P/DATA21/LVDS2A_12P/DQ27) ; port CLK_156p25M_1_P
CLK_DDR_SCL: U10.Y9(IO_2A_2_Y9/DEV_OE/LVDS2A_23P/DQ31) ; port CLK_DDR_SCL
CLK_DDR_SDA: U10.W10(IO_2A_3_W10/INIT_DONE/LVDS2A_23N/DQ31) ; port CLK_DDR_SDA
CLK_OUT_1: R105.2 ; port CLK_OUT_1
CLK_OUT_2: R103.2 ; port CLK_OUT_2
ENET_GTX_CLK: U10.E5(IO_2L_47_E5/DQ0) ; port ENET_GTX_CLK
ENET_INTn: U10.C7(IO_2L_30_C7/DQ2) ; port ENET_INTn
ENET_MDC: U10.C8(IO_2L_31_C8/DQ2) ; port ENET_MDC
ENET_MDIO: U10.E10(IO_2L_32_E10/DQS2) ; port ENET_MDIO
ENET_RESETn: U10.E11(IO_2L_33_E11/DQSN2) ; port ENET_RESETn
ENET_RX_CLK: U10.F3(IO_2L_40_F3/DQS1) ; port ENET_RX_CLK
ENET_RX_DV: U10.G5(IO_2L_39_G5/DQ1) ; port ENET_RX_DV
ENET_RXD0: U10.G4(IO_2L_38_G4/DQ1) ; port ENET_RXD0
ENET_RXD1: U10.F8(IO_2L_37_F8/DQ1) ; port ENET_RXD1
ENET_RXD2: U10.F7(IO_2L_36_F7/DQ1) ; port ENET_RXD2
ENET_RXD3: U10.E9(IO_2L_35_E9/DQ2) ; port ENET_RXD3
ENET_TX_EN: U10.E4(IO_2L_46_E4/DQ0) ; port ENET_TX_EN
ENET_TXD0: U10.D5(IO_2L_45_D5/DQSN0) ; port ENET_TXD0
ENET_TXD1: U10.D4(IO_2L_44_D4/DQS0) ; port ENET_TXD1
ENET_TXD2: U10.E7(IO_2L_43_E7/DQ0) ; port ENET_TXD2
ENET_TXD3: U10.E6(IO_2L_42_E6/DQ0) ; port ENET_TXD3
FLED1: R106.2 U10.E2(IO_2L_3_E2/DQ7)
FLED2: R107.2 U10.E1(IO_2L_2_E1/DQ7)
FLED3: R109.2 U10.F2(IO_2L_1_F2/DQ7)
FLED4: R110.2 U10.F1(IO_2L_0_F1/DQ7)
SFP1_MOD_ABS: U10.W8(IO_2A_8_W8/LVDS2A_20P/DQS30) ; port SFP1_MOD_ABS
SFP1_RX_LOS: U10.AA9(IO_2A_11_AA9/PR_READY/LVDS2A_19N/DQ30) ; port SFP1_RX_LOS
SFP1_SCL: U10.AA13(IO_2A_7_AA13/PR_ERROR/LVDS2A_21N/DQ30) ; port SFP1_SCL
SFP1_SDA: U10.AA12(IO_2A_6_AA12/LVDS2A_21P/DQ30) ; port SFP1_SDA
SFP1_TX_DIS: U10.W9(IO_2A_9_W9/PR_DONE/LVDS2A_20N/DQSN30) ; port SFP1_TX_DIS
SFP1_TX_FAULT: U10.AB8(IO_2A_10_AB8/NPERSTL0/LVDS2A_19P/DQ30) ; port SFP1_TX_FAULT
SMA_CLK_IN: U10.C5(IO_2L_C5/CLK_2L_1P/DQ3) ; port SMA_CLK_IN
SMA_CLK_OUT: R104.2 ; port SMA_CLK_OUT
TEMP_ALERT_n: U10.AE9(IO_2A_44_AE9/DATA3/LVDS2A_2P/DQS24) ; port TEMP_ALERT_n
TEMP_I2C_CLK: U10.AE5(IO_2A_47_AE5/DATA0/LVDS2A_1N/DQ24) ; port TEMP_I2C_CLK
TEMP_I2C_DATA: U10.AE4(IO_2A_46_AE4/DATA1/LVDS2A_1P/DQ24) ; port TEMP_I2C_DATA
TEMP_OVERT_n: U10.AD9(IO_2A_45_AD9/DATA2/LVDS2A_2N/DQSN24) ; port TEMP_OVERT_n
XCVR_CAL_CLK_100M: R108.2 TP15.1 U10.AC13(IO_2A_13_AC13/CLKUSR/LVDS2A_18N/DQ29)
NetC141_1: C141.1 C142.2 L8.2 X1.1(STBY) X1.4(VCC)
NetLED3_1: LED3.1(A) R106.1
NetLED4_1: LED4.1(A) R107.1
NetLED5_1: LED5.1(A) R109.1
NetLED6_1: LED6.1(A) R110.1
NetR103_1: R103.1 U10.AC6(IO_2A_28_AC6/PLL_2A_CLKOUT1P,PLL_2A_CLKOUT1,PLL_2A_FB1/DATA19/LVDS2A_10P/DQS27)
NetR104_1: R104.1 U10.A7(IO_2L_18_A7/PLL_2L_CLKOUT0P,PLL_2L_CLKOUT0,PLL_2L_FB0/DQ4)
NetR105_1: R105.1 U10.Y15(IO_2A_18_Y15/PLL_2A_CLKOUT0P,PLL_2A_CLKOUT0,PLL_2A_FB0/DATA27/LVDS2A_15P/DQ28)
NetR108_1: R108.1 X1.3(OUTPUT)

Not connected (* = marked no-connect by the designer): U10 A2(IO_2L_4_A2/DQS7) A3(IO_2L_5_A3/DQSN7) A4(IO_2L_20_A4/DQS4) A6(IO_2L_A6/CLK_2L_0P/DQ4) A8(IO_2L_12_A8/DQ5) A9(IO_2L_13_A9/DQ5) AA7(IO_2A_4_AA7/LVDS2A_22P/DQS31) AA8(IO_2A_5_AA8/CVP_CONFDONE/LVDS2A_22N/DQSN31) AA11(IO_2A_1_AA11/CRC_ERROR/LVDS2A_24N/DQ31) AB5(IO_2A_30_AB5/DATA17/LVDS2A_9P/DQ26) AB6(IO_2A_31_AB6/DATA16/LVDS2A_9N/DQ26) AB9(IO_2A_26_AB9/RZQ_2A/LVDS2A_11P/DQ27) AB10(IO_2A_27_AB10/NCEO/LVDS2A_11N/DQ27) AB11(IO_2A_15_AB11/DATA30/LVDS2A_17N/DQ29) AB13(IO_2A_16_AB13/DATA29/LVDS2A_16P/DQS29) AB14(IO_2A_17_AB14/DATA28/LVDS2A_16N/DQSN29) AC7(IO_2A_29_AC7/PLL_2A_CLKOUT1N/DATA18/LVDS2A_10N/DQSN27) AC10(IO_2A_33_AC10/DATA14/LVDS2A_8N/DQSN26) AC11(IO_2A_14_AC11/DATA31/LVDS2A_17P/DQ29) AC12(IO_2A_12_AC12/PR_REQUEST/LVDS2A_18P/DQ29) AD7(IO_2A_43_AD7/DATA4/LVDS2A_3N/DQ24) AD8(IO_2A_34_AD8/DATA13/LVDS2A_7P/DQ26) AD10(IO_2A_32_AD10/DATA15/LVDS2A_8P/DQS26) AD12(IO_2A_20_AD12/DATA25/LVDS2A_14P/DQS28) AD13(IO_2A_21_AD13/DATA24/LVDS2A_14N/DQSN28) B1(IO_2L_6_B1/DQ6) B3(IO_2L_14_B3/DQ5) B4(IO_2L_15_B4/DQ5) B5(IO_2L_21_B5/DQSN4) B6(IO_2L_B6/CLK_2L_0N/DQ4) B8(IO_2L_19_B8/PLL_2L_CLKOUT0N/DQ4) B9(IO_2L_16_B9/DQS5) B10(IO_2L_17_B10/DQSN5) C1(IO_2L_7_C1/DQ6) C2(IO_2L_8_C2/DQS6) C3(IO_2L_9_C3/DQSN6) C6(IO_2L_C6/CLK_2L_1N/DQ3) C10(IO_2L_C10/RZQ_2L/DQ3) D2(IO_2L_10_D2/DQ6) D3(IO_2L_11_D3/DQ6) D7(IO_2L_28_D7/PLL_2L_CLKOUT1P,PLL_2L_CLKOUT1,PLL_2L_FB1/DQS3) D8(IO_2L_29_D8/PLL_2L_CLKOUT1N/DQSN3) D9(IO_2L_34_D9/DQ2) D10(IO_2L_27_D10/DQ3) F4(IO_2L_41_F4/DQSN1) W15(IO_2A_19_W15/PLL_2A_CLKOUT0N/DATA26/LVDS2A_15N/DQ28) Y10(IO_2A_0_Y10/DEV_CLRN/LVDS2A_24P/DQ31) Y14(IO_2A_23_Y14/CLK_2A_0N/DATA22/LVDS2A_13N/DQ28)

### Library data of the parts
C141 = Cap Tant: Tantalum Polarized Capacitor; RATED_VOLTAGE: 6.3V; Value: 10uF
C142 = Cap SMD: as C4 on sheet [01] - PWR 0V9, PWR SEQ; Value: 1uF; Manufacturer Part Num: *; Dielectric: *
L8 = Ferrite Bead: Value: 220@100Mhz
LED3-LED6 = LED: Typical LED; Value: RED
R103-R110 = Res SMD: SMD Resistor; Tolerance: 5%; Manufacturer Part Num: *
  R103-R105 R108: Value: 33
  R106 R107 R109 R110: Value: 100
TP15 TP16 = Test Point: Test Point Footprint; Value: Test Point
U10 = 10AX016: Value: 10AX016 F27; Manufacturer Part Num: *
X1 = XTAL OSC: Crystal Oscillator; Manufacturer Part Num: ECS-3518-1000-B-TR; Value: 100MHz